# EAGLE design USBDroidR3 (EAGLE 6.2)
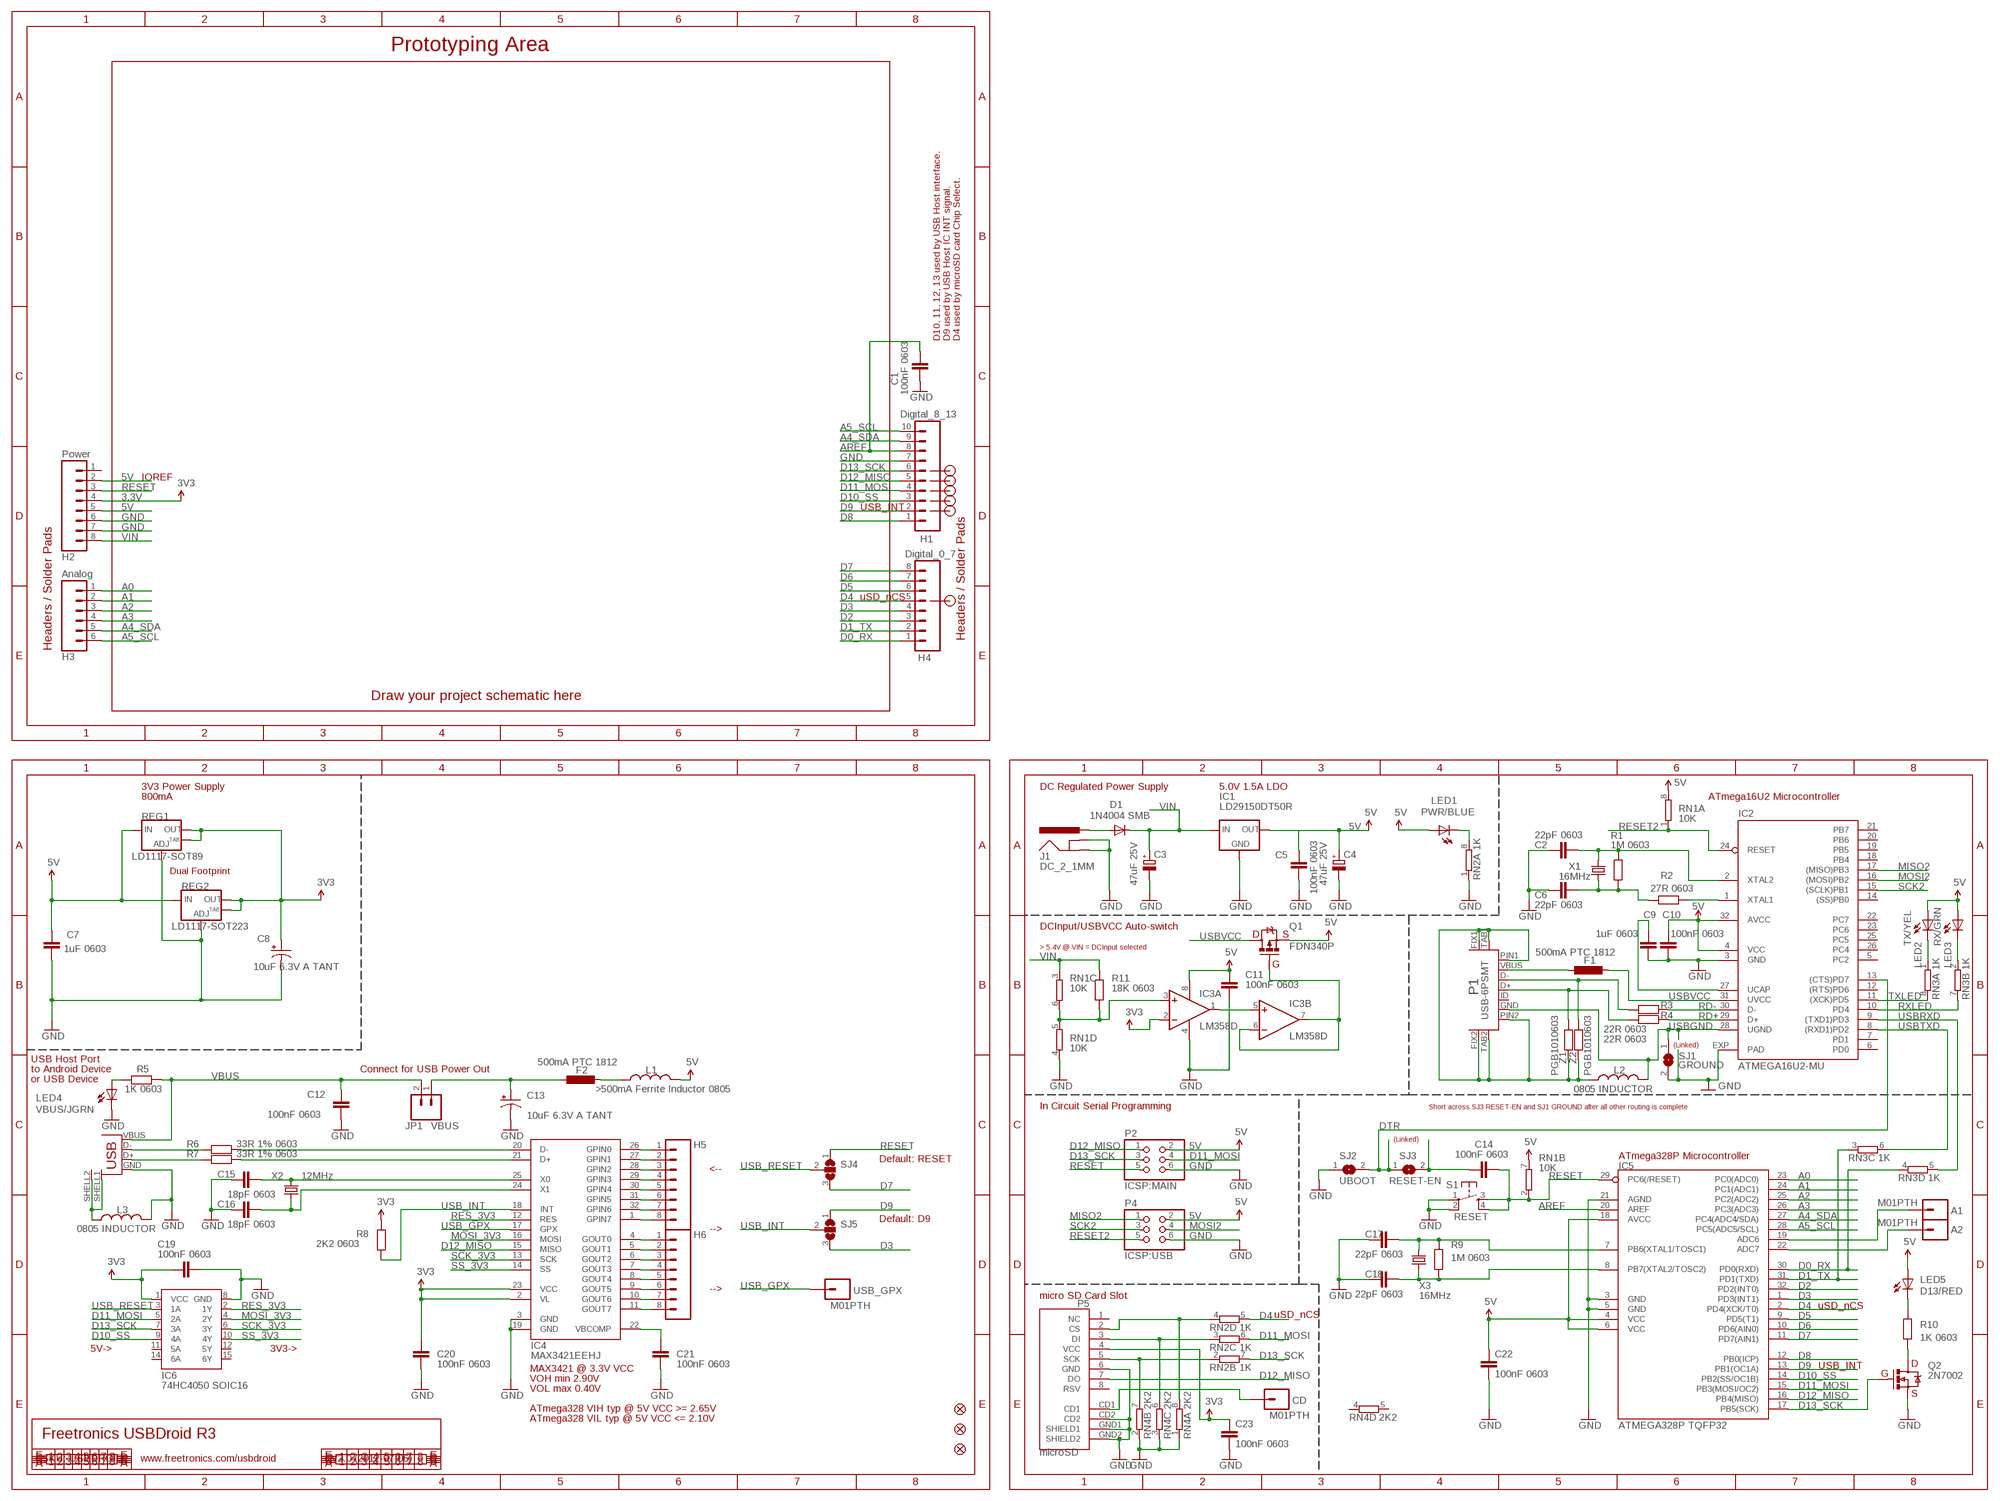
[diagram p0: schematic, sheet 1]

## Parts
A1  M01PTH  [1X01]
A2  M01PTH  [1X01]
C1  100nF 0603  CAP0603  [0603]
C2  22pF 0603  CAP0603  [0603]
C3  47uF 25V  CPOL-EUD  [PANASONIC_D]
C4  47uF 25V  CPOL-EUD  [PANASONIC_D]
C5  100nF 0603  CAP0603  [0603]
C6  22pF 0603  CAP0603  [0603]
C7  1uF 0603  CAP0603  [0603]
C8  10uF 6.3V A TANT  CAP_POL1206  [EIA3216]
C9  1uF 0603  CAP0603  [0603]
C10  100nF 0603  CAP0603  [0603]
C11  100nF 0603  CAP0603  [0603]
C12  100nF 0603  CAP0603  [0603]
C13  10uF 6.3V A TANT  CAP_POL1206  [EIA3216]
C14  100nF 0603  CAP0603  [0603]
C15  18pF 0603  CAP0603  [0603]
C16  18pF 0603  CAP0603  [0603]
C17  22pF 0603  CAP0603  [0603]
C18  22pF 0603  CAP0603  [0603]
C19  100nF 0603  CAP0603  [0603]
C20  100nF 0603  CAP0603  [0603]
C21  100nF 0603  CAP0603  [0603]
C22  100nF 0603  CAP0603  [0603]
C23  100nF 0603  CAP0603  [0603]
CD  M01PTH  [1X01]
D1  1N4004 SMB  DIODESMB  [SMB-DIODE]
F1  500mA PTC 1812  L-EUL1812  [L1812]
F2  500mA PTC 1812  L-EUL1812  [L1812]
FID1  FIDUCIAL1X2.5  [FIDUCIAL-1X2.5]
FID2  FIDUCIAL1X2.5  [FIDUCIAL-1X2.5]
FID3  FIDUCIAL1X2.5  [FIDUCIAL-1X2.5]
H1  Digital_8_13  M100.1  [1X10]
H2  Power  M08  [1X08]
H3  Analog  M06SIP  [1X06]
H4  Digital_0_7  M08  [1X08]
H5  GPIN  M08  [1X08]
H6  GPIN  M08  [1X08]
IC1  LD29150DT50R  V_REG_78XX  [DPACK]
IC2  ATMEGA16U2-MU  ATMEL_ATMEGA8U2-MUQFN  [ATMEL_QFN32]
IC3  LM358D  [SO08]
IC4  MAX3421EEHJ  MAX3421ESMD  [TQFP32-5MM]
IC5  ATMEGA328P TQFP32  AVR-MEGA8-AI  [TQFP32-08]
IC6  74HC4050 SOIC16  HEX_CONVERTER  [SO016]
J1  DC_2_1MM  POWER_JACKPTH  [POWER_JACK_PTH]
JP1  VBUS  M02LOCK  [1X02_LOCK]
L1  >500mA Ferrite Inductor 0805  INDUCTOR0805-LARGE  [0805-LARGE]
L2  0805 INDUCTOR  INDUCTOR0805-LARGE  [0805-LARGE]
L3  0805 INDUCTOR  INDUCTOR0805-LARGE  [0805-LARGE]
LED1  PWR/BLUE  LED0603  [LED-0603]
LED2  TX/YEL  LED0603  [LED-0603]
LED3  RX/GRN  LED0603  [LED-0603]
LED4  VBUS/JGRN  LED0603  [LED-0603]
LED5  D13/RED  LED0603  [LED-0603]
P1  USB-6PSMT  [USB-MICROB-MB05PMXX]
P2  ICSP:MAIN  PINHD-2X3  [2X03]
P3  USB_  [USB-A-S-SILK-FEMALE]
P4  ICSP:USB  PINHD-2X3  [2X03]
P5  microSD  USD-SOCKETNEW  [MICRO-SD-SOCKET-PP]
Q1  FDN340P  MOSFET-PCHANNEL  [SOT23]
Q2  2N7002  MOSFET-NCHANNELSMD  [SOT23-3]
R1  1M 0603  RESISTOR0603  [0603]
R2  27R 0603  RESISTOR0603  [0603]
R3  22R 0603  RESISTOR0603  [0603]
R4  22R 0603  RESISTOR0603  [0603]
R5  1K 0603  RESISTOR0603  [0603]
R6  33R 1% 0603  RESISTOR0603  [0603]
R7  33R 1% 0603  RESISTOR0603  [0603]
R8  2K2 0603  RESISTOR0603  [0603]
R9  1M 0603  RESISTOR0603  [0603]
R10  1K 0603  RESISTOR0603  [0603]
R11  18K 0603  RESISTOR0603  [0603]
REG1  LD1117-SOT89  V_REG_LM1117SOT89  [SOT89]
REG2  LD1117-SOT223  V_REG_LM1117SOT223  [SOT223]
RN1  10K  4R-NCAY16  [CAY16]
RN2  1K  4R-NCAY16  [CAY16]
RN3  1K  4R-NCAY16  [CAY16]
RN4  2K2  4R-NCAY16  [CAY16]
S1  RESET  TAC_SWITCHSMD  [TACTILE_SWITCH_SMD]
SJ1  GROUND  SJ  [SJ]
SJ2  UBOOT  SJ  [SJ]
SJ3  RESET-EN  SJ  [SJ]
SJ4  SJ2W  [SJ_2]
SJ5  SJ2W  [SJ_2]
USB_GPX  M01PTH  [1X01]
X1  16MHz  CRYSTALHC49UV  [HC49U-V]
X2  12MHz  CRYSTALHC49UV  [HC49U-V]
X3  16MHz  CRYSTALHC49UV  [HC49U-V]
Z1  PGB1010603  RESISTOR0603  [0603]
Z2  PGB1010603  RESISTOR0603  [0603]

## Nets
3.3V: C8.A(+) C19.2 C20.2 C23.1 H2.4 IC3.2(A:-IN) IC4.2(VL) IC4.23(VCC) IC6.1(VCC) P5.4(VCC) R8.1 REG1.2(OUT) REG1.4(OUT) REG2.2(OUT) REG2.4(OUT) ; supply symbol labelled 3V3
5V [power]: C4.+ C5.1 C7.1 C10.1 C11.1 C22.1 H2.2 H2.5 IC1.3(OUT) IC2.4(VCC) IC2.32(AVCC) IC3.8(P:V+) IC5.4(VCC) IC5.6(VCC) IC5.18(AVCC) L1.2 LED1.A LED2.A LED3.A LED5.A P2.2 P4.2 Q1.2(S) REG1.3(IN) REG2.3(IN) RN1.7 RN1.8
A0: H3.1 IC5.23(PC0(ADC0))
A1: H3.2 IC5.24(PC1(ADC1))
A2: H3.3 IC5.25(PC2(ADC2))
A3: H3.4 IC5.26(PC3(ADC3))
A4_SDA: H1.9 H3.5 IC5.27(PC4(ADC4/SDA))
A5_SCL: H1.10 H3.6 IC5.28(PC5(ADC5/SCL))
AREF: C1.1 H1.8 IC5.20(AREF)
D0_RX: H4.1 IC5.30(PD0(RXD)) RN3.4
D1_TX: H4.2 IC5.31(PD1(TXD)) RN3.3
D2: H4.3 IC5.32(PD2(INT0))
D3: H4.4 IC5.1(PD3(INT1)) SJ5.3
D4: H4.5 IC5.2(PD4(XCK/T0)) RN2.5
D5: H4.6 IC5.9(PD5(T1))
D6: H4.7 IC5.10(PD6(AIN0))
D7: H4.8 IC5.11(PD7(AIN1)) SJ4.3
D8: H1.1 IC5.12(PB0(ICP))
D9: H1.2 IC5.13(PB1(OC1A)) SJ5.1
D10_SS: H1.3 IC5.14(PB2(SS/OC1B)) IC6.9(4A)
D11_MOSI: H1.4 IC5.15(PB3(MOSI/OC2)) IC6.5(2A) P2.4 RN2.6
D12_MISO: H1.5 IC4.15(MISO) IC5.16(PB4(MISO)) P2.1 P5.7(DO)
D13_SCK: H1.6 IC5.17(PB5(SCK)) IC6.7(3A) P2.3 Q2.1(G) RN2.7
DTR: IC2.13((CTS)PD7) SJ2.2 SJ3.1
GND: C1.2 C2.1 C3.- C4.- C5.2 C6.1 C7.2 C8.C(-) C9.2 C10.2 C11.2 C12.1 C13.C(-) C15.1 C16.1 C17.1 C18.1 C19.1 C20.1 C21.1 C22.2 C23.2 H1.7 H2.6 H2.7 IC1.2(GND) IC2.3(GND) IC2.EXP(PAD) IC3.4(P:V-) IC4.3(GND) IC4.19(GND) IC5.3(GND) IC5.5(GND) IC5.21(AGND) IC6.8(GND) J1.GND J1.GNDBREAK L3.2 LED4.C P2.6 P3.GND P4.6 P5.6(GND) P5.CD2 P5.GND1(SHIELD1) P5.GND2(SHIELD2) Q2.2(S) REG1.1(ADJ) REG2.1(ADJ) RN1.4 RN2.1 RN4.1 RN4.2 RN4.3 S1.1 S1.2 SJ1.2 SJ2.1
MISO2: IC2.17((MISO)PB3) P4.1
MOSI2: IC2.16((MOSI)PB2) P4.4
MOSI_3V3: IC4.16(MOSI) IC6.4(2Y)
N$1: P3.D- R6.2
N$2: C17.2 IC5.7(PB6(XTAL1/TOSC1)) R9.2 X3.2
N$3: P3.D+ R7.2
N$4: LED5.C R10.2
N$5: IC4.20(D-) R6.1
N$6: Q2.3(D) R10.1
N$7: C18.2 IC5.8(PB7(XTAL2/TOSC2)) R9.1 X3.1
N$8: IC2.1(XTAL1) R2.1
N$10: IC4.21(D+) R7.1
N$11: LED3.C RN3.2
N$12: IC3.3(A:+IN) R11.1 RN1.5 RN1.6
N$13: LED2.C RN3.1
N$14: LED1.C RN2.8
N$15: H5.1 IC4.26(GPIN0)
N$16: P1.D+ R4.2 Z1.1
N$17: P1.D- R3.2 Z2.1
N$18: IC3.6(B:-IN) IC3.7(B:OUT) Q1.1(G)
N$19: IC3.1(A:OUT) IC3.5(B:+IN)
N$20: P5.2(CS) RN2.4 RN4.8
N$21: A2.1 IC5.22(ADC7)
N$22: A1.1 IC5.19(ADC6)
N$23: CD.1 P5.CD1
N$24: P5.5(SCK) RN2.2 RN4.7
N$25: P5.3(DI) RN2.3 RN4.6
N$26: H5.2 IC4.27(GPIN1)
N$27: C15.2 IC4.25(X0) X2.2
N$28: H5.3 IC4.28(GPIN2)
N$29: C13.A(+) F2.1 JP1.1
N$30: C16.2 IC4.24(X1) X2.1
N$31: H5.4 IC4.29(GPIN3)
N$32: H5.5 IC4.30(GPIN4)
N$33: H5.6 IC4.31(GPIN5)
N$34: H5.7 IC4.32(GPIN6)
N$35: H5.8 IC4.1(GPIN7)
N$36: H6.1 IC4.4(GOUT0)
N$37: H6.2 IC4.5(GOUT1)
N$38: H6.3 IC4.6(GOUT2)
N$39: H6.4 IC4.7(GOUT3)
N$40: H6.5 IC4.8(GOUT4)
N$41: H6.6 IC4.9(GOUT5)
N$42: H6.7 IC4.10(GOUT6)
N$43: H6.8 IC4.11(GOUT7)
N$44: LED4.A R5.1
N$45: L3.1 P3.SHELL1 P3.SHELL2
N$46: F2.2 L1.1
N$48: C21.2 IC4.22(VBCOMP)
N$49: C14.1 SJ3.2
N$51: L2.1 P1.FIX1 P1.FIX2 P1.PIN1 P1.PIN2 P1.TAB1 P1.TAB2 Z1.2 Z2.2
N$60: D1.A J1.PWR
N$113: C2.2 IC2.2(XTAL2) R1.2 X1.2
N$114: C6.2 R1.1 R2.2 X1.1
N$115: F1.1 P1.VBUS
N$117: C9.1 IC2.27(UCAP)
RD+: IC2.29(D+) R4.1
RD-: IC2.30(D-) R3.1
RES_3V3: IC4.12(RES) IC6.2(1Y)
RESET: C14.2 H2.3 IC5.29(PC6(/RESET)) P2.5 RN1.2 S1.3 S1.4 SJ4.1
RESET2: IC2.24(RESET) P4.5 RN1.1
RXLED: IC2.10(PD4) RN3.7
SCK2: IC2.15((SCLK)PB1) P4.3
SCK_3V3: IC4.13(SCK) IC6.6(3Y)
SS_3V3: IC4.14(SS) IC6.10(4Y)
TXLED: IC2.11((XCK)PD5) RN3.8
USB_GPX: IC4.17(GPX) USB_GPX.1
USB_INT: IC4.18(INT) R8.2 SJ5.2
USB_RESET: IC6.3(1A) SJ4.2
USBGND: IC2.28(UGND) L2.2 P1.GND SJ1.1
USBRXD: IC2.9((TXD1)PD3) RN3.5
USBTXD: IC2.8((RXD1)PD2) RN3.6
USBVCC: F1.2 IC2.31(UVCC) Q1.3(D)
VBUS: C12.2 JP1.2 P3.VBUS R5.2
VIN: C3.+ D1.C H2.8 IC1.1(IN) R11.2 RN1.3
Unconnected: H2.1 IC2.5(PC2) IC2.6(PD0) IC2.7(PD1) IC2.12((RTS)PD6) IC2.14((SS)PB0) IC2.18(PB4) IC2.19(PB5) IC2.20(PB6) IC2.21(PB7) IC2.22(PC7) IC2.23(PC6) IC2.25(PC5) IC2.26(PC4) IC6.11(5A) IC6.12(5Y) IC6.14(6A) IC6.15(6Y) P1.ID P5.1(NC) P5.8(RSV) RN4.4 RN4.5

## Notes on the sheet
- Prototyping Area
- D10, 11, 12, 13 used by USB Host interface. | D9 used by USB Host IC INT signal. | D4 used by microSD card Chip Select.
- IOREF
- USB_INT
- uSD_nCS
- Headers / Solder Pads
- Headers / Solder Pads
- Draw your project schematic here
- 3V3 Power Supply | DC Regulated Power Supply | 5.0V 1.5A LDO
- 800mA | ATmega16U2 Microcontroller
- Dual Footprint
- DCInput/USBVCC Auto-switch
- D | S
- > 5.4V @ VIN = DCInput selected
- G
- (Linked)
- USB Host Port
- to Android Device | Connect for USB Power Out
- or USB Device
- In Circuit Serial Programming | Short across SJ3 RESET-EN and SJ1 GROUND after all other routing is complete
- (Linked)
- ATmega328P Microcontroller
- Default: RESET
- <--
- Default: D9
- -->
- -->
- micro SD Card Slot
- uSD_nCS
- uSD_nCS
- 5V-> | 3V3->
- USB_INT | D
- MAX3421 @ 3.3V VCC
- G
- VOH min 2.90V
- VOL max 0.40V
- S
- ATmega328 VIH typ @ 5V VCC >= 2.65V
- ATmega328 VIL typ @ 5V VCC <= 2.10V
- Freetronics USBDroid R3
- SKU: USBDROID | www.freetronics.com/usbdroid | V2.0 (2012-07-06)

## Library data of the parts
A1 A2 CD USB_GPX = freetronics-2:M01: Header 1 Standard 1-pin 0.1" header. Use with straight break away headers (SKU : PRT-00116), right angle break away headers (PRT-00553), swiss pins (PRT-00743), machine pins (PRT-00117), and female headers (PRT-00115).
C1 C2 C5-C7 C9-C12 C14-C23 = freetronics:CAP: Capacitor Standard 0603 ceramic capacitor, and 0.1" leaded capacitor.
C3 C4 = rcl:CPOL-EU: POLARIZED CAPACITOR, European symbol
C8 C13 = freetronics:CAP_POL: Capacitor Polarized These are standard SMD and PTH capacitors. Normally 10uF, 47uF, and 100uF in electrolytic and tantalum varieties. Always verify the external diameter of the through hole cap, it varies with capacity, voltage, and manufacturer. The EIA devices should be standard.
D1 = freetronics:DIODE: Diode These are standard reverse protection diodes and small signal diodes. SMA package can handle up to about 1A. SOD-323 can handle about 200mA. What the SOD-323 package when ordering, there are some mfgs out there that are 5-pin packages.
F1 F2 = rcl:L-EU: INDUCTOR, European symbol
FID1-FID3 = freetronics:FIDUCIAL: Fiducial Alignment Points Various fiducial points for machine vision alignment.
H1 = freetronics-original:M10: Header 10 Standard 10-pin 0.1" header. Use with straight break away headers (SKU : PRT-00116), right angle break away headers (PRT-00553), swiss pins (PRT-00743), machine pins (PRT-00117), and female headers (PRT-00115).
H2 = freetronics-master-v1:M08: Header 8 Standard 8-pin 0.1" header. Use with straight break away headers (SKU : PRT-00116), right angle break away headers (PRT-00553), swiss pins (PRT-00743), machine pins (PRT-00117), and female headers (PRT-00115).
H3 = freetronics:M06: Header 6 Standard 6-pin 0.1" header. Use with straight break away headers (SKU : PRT-00116), right angle break away headers (PRT-00553), swiss pins (PRT-00743), machine pins (PRT-00117), and female headers (PRT-00115). Molex polarized connector foot print use with SKU : PRT-08094 with associated crimp pins and housings. NOTES ON THE VARIANTS LOCK and LOCK_LONGPADS... This footprint was designed to help hold the alignment of a through-hole component (i.e. 6-pin header) while soldering it into place. You may notice that each hole has been shifted either up or down by 0.005 of an inch from it's more standard position (which is a perfectly straight line). This slight alteration caused the pins (the squares in the middle) to touch the edges of the holes. Because they are alternating, it causes a "brace" to hold the component in place. 0.005 has proven to be the perfect amount of "off-center" position when using our standard breakaway headers. Although looks a little odd when you look at the bare footprint, once you have a header in there, the alteration is very hard to notice. Also, if you push a header all the way into place, it is covered up entirely on the bottom side. This idea of altering the position of holes to aid alignment will be further integrated into the Sparkfun Library for other footprints. It can help hold any component with 3 or more connection pins.
H4-H6 = freetronics:M08: Header 8 Standard 8-pin 0.1" header. Use with straight break away headers (SKU : PRT-00116), right angle break away headers (PRT-00553), swiss pins (PRT-00743), machine pins (PRT-00117), and female headers (PRT-00115).
IC1 = freetronics-master-v1:V_REG_78XX: Voltage Regulator Standard 7805 5V regulator. IGO (Input Ground Output). Spark Fun Electronics SKU : COM-00107
IC2 = freetronics-jon:ATMEL_ATMEGA8U2-MU
IC3 = linear:LM358: OP AMP also LM158; LM258; LM2904 Source: http://cache.national.com/ds/LM/LM158.pdf
IC4 = freetronics-master-v1:MAX3421E: USB Peripheral/Host Controller w/ SPI
IC5 = freetronics-2:AVR-MEGA8: MICROCONTROLLER 8 Kbytes FLASH 1 kbytes SRAM 512 bytes EEPROM USART 6-channel 10 bit ADC 2-channel 8 bit ADC
IC6 = freetronics-master-v1:HEX_CONVERTER
J1 = freetronics:POWER_JACK: Power Jack This is the standard 5.5mm barrel jack for power. The PTH is the most common, proven, reliable, footprint. All others are experimental. The Slot footprint only works if the mill layer is transmitted to the PCB fab house so be warned. Spark Fun Electronics SKU : PRT-00119. Mating wall wart : TOL-00298 (and others)
JP1 = freetronics-master-v1:M02: Header 2 Standard 2-pin 0.1" header. Use with straight break away headers (SKU : PRT-00116), right angle break away headers (PRT-00553), swiss pins (PRT-00743), machine pins (PRT-00117), and female headers (PRT-00115). Molex polarized connector foot print use with SKU : PRT-08233 with associated crimp pins and housings.
L1-L3 = freetronics-master-v1:INDUCTOR: Inductors Basic Inductor/Choke - 0603 and 1206. Footprints are not proven and vary greatly between part numbers.
LED1-LED5 = freetronics:LED: LEDs Standard schematic elements and footprints for 5mm, 3mm, 1206, and 0603 sized LEDs. 5mm - Spark Fun Electronics SKU : COM-00529 (and others)
P1 = freetronics-jon:USB-6P
P2 P4 = pinhead:PINHD-2X3: PIN HEADER
P3 = freetronics-master-v1:USB: USB Connectors USB-B-PTH is fully proven SKU : PRT-00139 USB-miniB is fully proven SKU : PRT-00587 USB-A-PCB is untested. USB-A-H is throughly reviewed, but untested. Spark Fun Electronics SKU : PRT-00437 USB-B-SMT is throughly reviewed, but untested. Needs silkscreen touching up. USB-A-S has not been used/tested USB-MB-H has not been used/tested
P5 = freetronics-master-v1:USD-SOCKET: microSD Socket Push-push type uSD socket. Schematic element and footprint production proven. Spark Fun Electronics SKU : PRT-00127. tDoc lines correctly indicate media card edge positions when inserting (unlocked, locked, depressed).
Q1 = freetronics-master-v1:MOSFET-PCHANNEL
Q2 = freetronics:MOSFET-NCHANNEL
R1-R11 Z1 Z2 = freetronics:RESISTOR: Resistor Basic schematic elements and footprints for 0603, 1206, and PTH 1/10th watt (small) resistors.
REG1 REG2 = freetronics:V_REG_LM1117: Voltage Regulator LD1117 Adjustable low-dropout voltage regulator available in SOT89 and SOT223 SMT packages.
RN1-RN4 = freetronics-master-v1:4R-N: Array Chip Resistor Source: RS Component / Phycomp
S1 = freetronics:TAC_SWITCH: Momentary Switch Button commonly used for reset or general input. Spark Fun Electronics SKU : COM-00097
SJ1-SJ3 = jumper:SJ: SMD solder JUMPER
SJ4 SJ5 = freetronics-master-v1:SJ2W: SMD solder JUMPER
X1-X3 = freetronics-master-v1:CRYSTAL: Crystals Various standard crystals. Proven footprints. Spark Fun Electronics SKU : COM-00534

## Net classes
0 default: width 0.152 mm

## Board
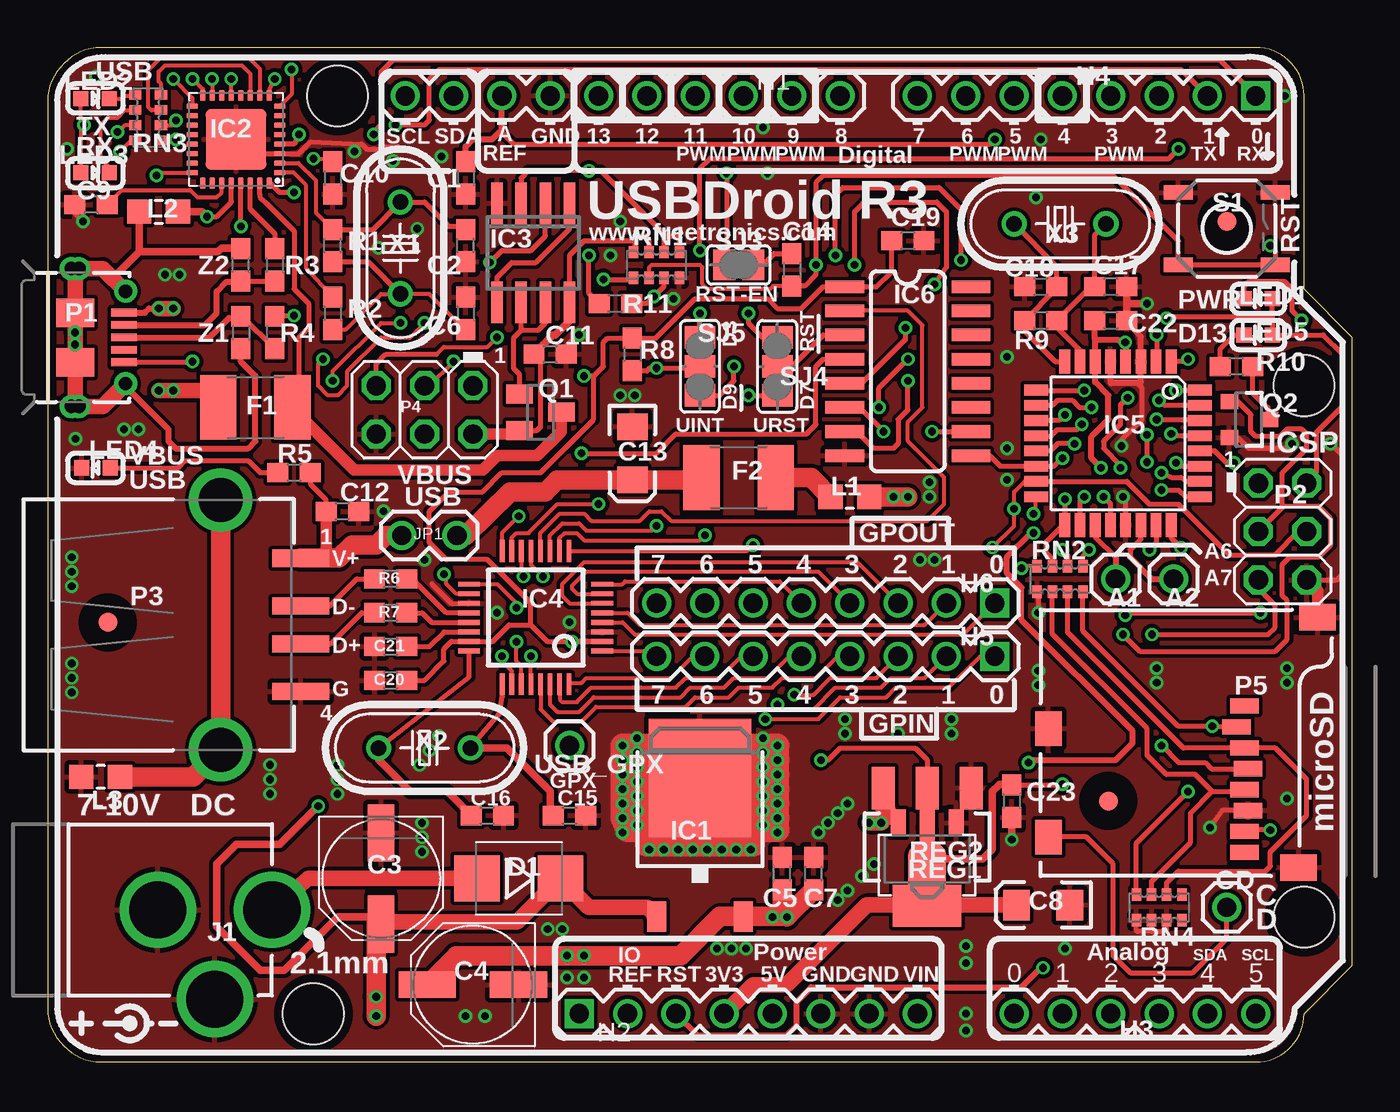
[diagram p1: board, top side]
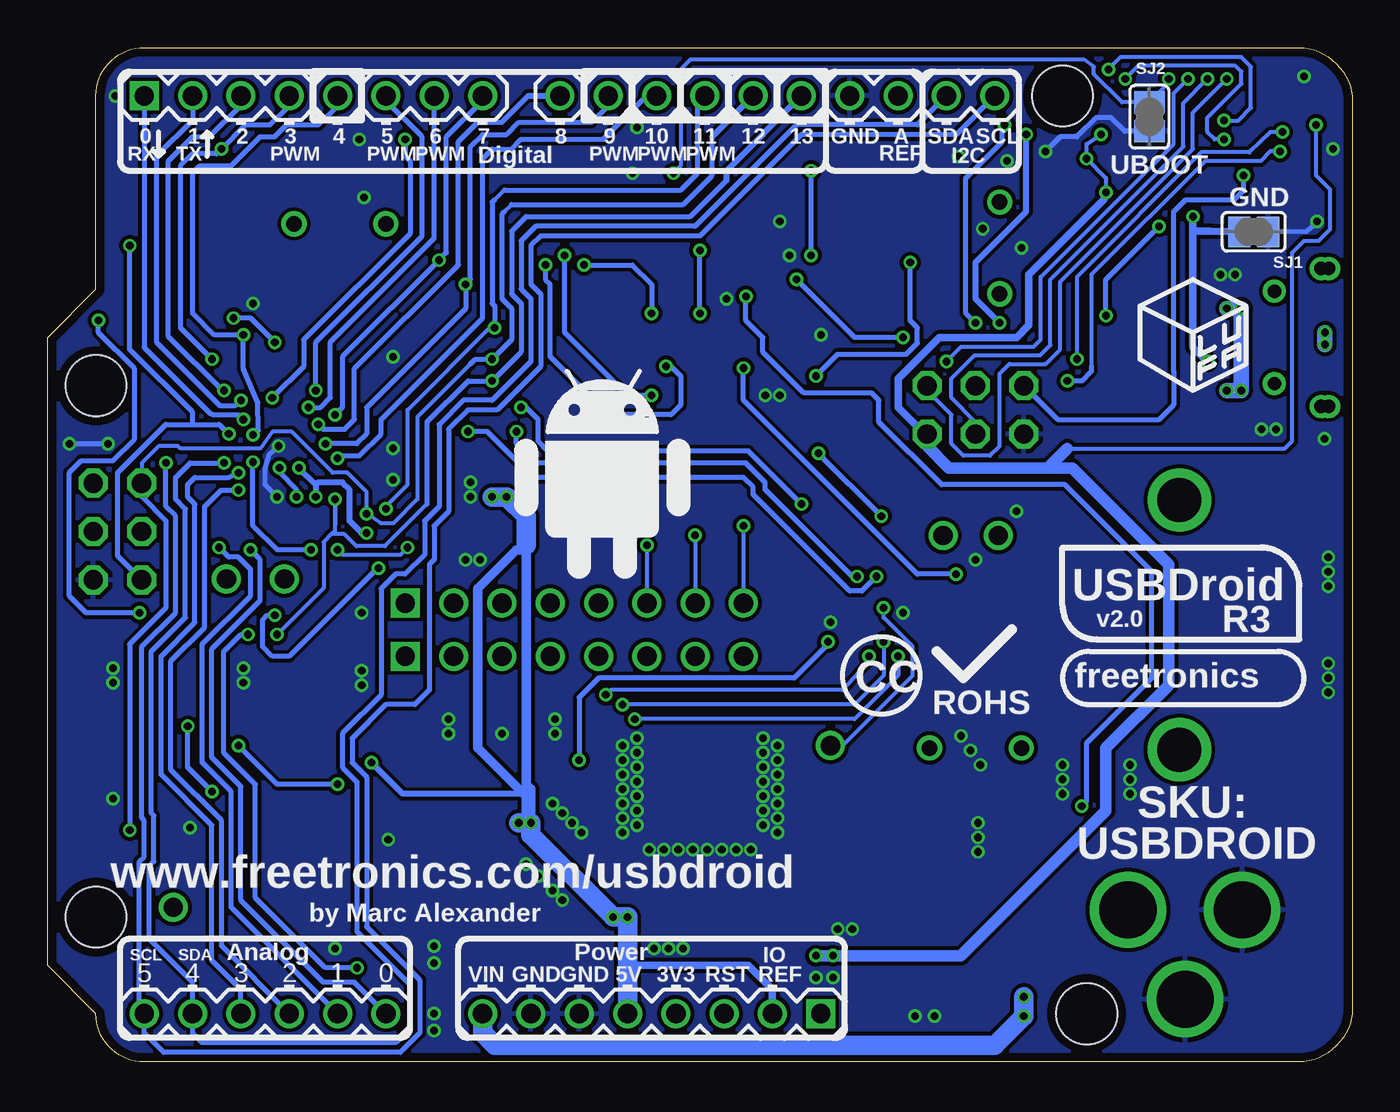
[diagram p2: board, bottom side, seen from below]

Size 68.58 x 53.34 mm. Coordinates in mm from the lower left corner, seen from the top.
Outline: 0,2.54 arc74 2.54,0 63.5,0 arc90 66.04,2.54 68.58,5.08 68.58,38.1 66.04,40.64 66.04,50.8 arc90 63.5,53.34 2.54,53.34 arc74 0,50.8 0,2.54
Copper layers (1*16): Top 0.035mm / dielectric 1.5mm / Bottom 0.035mm
Design rules: minimum track width 8mil, minimum drill 15mil, track to track 8mil, track to pad 8mil, pad to pad 8mil, via to via 8mil, smd to smd 8mil, copper to edge 18mil, drill to drill 8mil, minimum pad ring 10mil, minimum via ring 6mil, stop-mask expansion 4mil, vias tented up to drill 25mil, thermal gap 10mil
Holes 3.2 mm at 66.04,35.56 66.04,7.62 13.97,2.54 15.24,50.8
tRestrict: area 61,43.2 to 63,45.2; area 54.7,12.7 to 56.8,14.7; area 2.2,22.1 to 4.2,24.1

### Footprints (pad centres in the part's own frame; a part is rotated, then mirrored left to right if it is on the bottom)
1X01 = drill 1.016: 1 0,0
0603 = smd 1.1 x 1: 1 -0.85,0; 2 0.85,0
PANASONIC_D = smd 3 x 1.4: + 2.4,0; - -2.4,0
EIA3216 = smd 1.4 x 1.6: A 1.4,0; C -1.4,0
SMB-DIODE = smd 2.4 x 2.4: A 2.2,0; C -2.2,0
L1812 = smd 1.9 x 3.4: 1 -1.95,0; 2 1.95,0
FIDUCIAL-1X2.5 = smd 1 x 1: 1 0,0
1X10 = drill 1.016: 1 0,0; 2 2.54,0; 3 5.08,0; 4 7.62,0; 5 10.16,0; 6 12.7,0; 7 15.24,0; 8 17.78,0; 9 20.32,0; 10 22.86,0
1X08 = drill 1.016 square: 1 0,0 | drill 1.016: 2 2.54,0; 3 5.08,0; 4 7.62,0; 5 10.16,0; 6 12.7,0; 7 15.24,0; 8 17.78,0
1X06 = drill 1.016: 1 0,0; 2 2.54,0; 3 5.08,0; 4 7.62,0; 5 10.16,0; 6 12.7,0
DPACK = smd 1 x 1.6: 1 -2.28,-4.8; 3 2.28,-4.8 | smd 5.4 x 6.2: 2 0,2.5
ATMEL_QFN32 = smd 0.6 x 0.3: 1 -2.3,1.75; 2 -2.3,1.25; 3 -2.3,0.75; 4 -2.3,0.25; 5 -2.3,-0.25; 6 -2.3,-0.75; 7 -2.3,-1.25; 8 -2.3,-1.75; 17 2.3,-1.75; 18 2.3,-1.25; 19 2.3,-0.75; 20 2.3,-0.25; 21 2.3,0.25; 22 2.3,0.75; 23 2.3,1.25; 24 2.3,1.75 | smd 0.3 x 0.6: 9 -1.75,-2.3; 10 -1.25,-2.3; 11 -0.75,-2.3; 12 -0.25,-2.3; 13 0.25,-2.3; 14 0.75,-2.3; 15 1.25,-2.3; 16 1.75,-2.3; 25 1.75,2.3; 26 1.25,2.3; 27 0.75,2.3; 28 0.25,2.3; 29 -0.25,2.3; 30 -0.75,2.3; 31 -1.25,2.3; 32 -1.75,2.3 | smd 3.2 x 3.2: EXP 0,0
SO08 = smd 0.6 x 2.2: 1 -1.905,-2.6; 2 -0.635,-2.6; 3 0.635,-2.6; 4 1.905,-2.6; 5 1.905,2.6; 6 0.635,2.6; 7 -0.635,2.6; 8 -1.905,2.6
TQFP32-5MM = smd 1.143 x 0.254: 1 -3.5,1.75; 2 -3.5,1.25; 3 -3.5,0.75; 4 -3.5,0.25; 5 -3.5,-0.25; 6 -3.5,-0.75; 7 -3.5,-1.25; 8 -3.5,-1.75; 17 3.5,-1.75; 18 3.5,-1.25; 19 3.5,-0.75; 20 3.5,-0.25; 21 3.5,0.25; 22 3.5,0.75; 23 3.5,1.25; 24 3.5,1.75 | smd 0.254 x 1.143: 9 -1.75,-3.5; 10 -1.25,-3.5; 11 -0.75,-3.5; 12 -0.25,-3.5; 13 0.25,-3.5; 14 0.75,-3.5; 15 1.25,-3.5; 16 1.75,-3.5; 25 1.75,3.5; 26 1.25,3.5; 27 0.75,3.5; 28 0.25,3.5; 29 -0.25,3.5; 30 -0.75,3.5; 31 -1.25,3.5; 32 -1.75,3.5
TQFP32-08 = smd 1.27 x 0.559: 1 -4.293,2.8; 2 -4.293,2; 3 -4.293,1.2; 4 -4.293,0.4; 5 -4.293,-0.4; 6 -4.293,-1.2; 7 -4.293,-2; 8 -4.293,-2.8; 17 4.293,-2.8; 18 4.293,-2; 19 4.293,-1.2; 20 4.293,-0.4; 21 4.293,0.4; 22 4.293,1.2; 23 4.293,2; 24 4.293,2.8 | smd 0.559 x 1.27: 9 -2.8,-4.293; 10 -2,-4.293; 11 -1.2,-4.293; 12 -0.4,-4.293; 13 0.4,-4.293; 14 1.2,-4.293; 15 2,-4.293; 16 2.8,-4.293; 25 2.8,4.293; 26 2,4.293; 27 1.2,4.293; 28 0.4,4.293; 29 -0.4,4.293; 30 -1.2,4.293; 31 -2,4.293; 32 -2.8,4.293
SO016 = smd 0.66 x 2.032: 1 -4.445,-3.315; 2 -3.175,-3.315; 3 -1.905,-3.315; 4 -0.635,-3.315; 5 0.635,-3.315; 6 1.905,-3.315; 7 3.175,-3.315; 8 4.445,-3.315; 9 4.445,3.315; 10 3.175,3.315; 11 1.905,3.315; 12 0.635,3.315; 13 -0.635,3.315; 14 -1.905,3.315; 15 -3.175,3.315; 16 -4.445,3.315
POWER_JACK_PTH = drill 2.997: GND 0,7.7; GNDBREAK 4.7,10.7; PWR 0,13.7
1X02_LOCK = drill 1.016: 1 -0.178,0; 2 2.718,0
0805-LARGE = smd 1.27 x 1.27: 1 -1.016,0; 2 1.016,0
LED-0603 = smd 0.8 x 0.8: A 0,-0.75; C 0,0.75
USB-MICROB-MB05PMXX = smd 0.4 x 1.35: D+ 0,2.575; D- -0.65,2.575; GND 1.3,2.575; ID 0.65,2.575; VBUS -1.3,2.575 | smd 1.5 x 2: FIX1 -1.3,0; FIX2 1.3,0 | drill 0.7: PIN1 -2.425,2.65; PIN2 2.425,2.65; SLOT1 -3.625,-0.2; SLOT2 3.625,-0.2; TAB1 -3.625,0.2; TAB2 3.625,0.2
2X03 = drill 1.016 octagon: 1 -2.54,-1.27; 2 -2.54,1.27; 3 0,-1.27; 4 0,1.27; 5 2.54,-1.27; 6 2.54,1.27
USB-A-S-SILK-FEMALE = smd 3 x 0.9: D+ 7.212,-1; D- 7.212,1; GND 7.212,-3.5; VBUS 7.212,3.5 | drill 2.311: SHELL1 3,6.566; SHELL2 3,-6.566
MICRO-SD-SOCKET-PP = smd 0.8 x 1.5: 1 -8.94,10.7; 2 -7.84,10.3; 3 -6.74,10.7; 4 -5.64,10.9; 5 -4.54,10.7; 6 -3.44,10.9; 7 -2.34,10.7; 8 -1.24,10.7 | smd 1.8 x 1.4: CD1 -2.05,0.4; CD2 -7.75,0.4 | smd 1.4 x 1.9: GND1 -0.45,13.55; GND2 -13.6,14.55
SOT23 = smd 1 x 1.4: 1 -0.95,-1.1; 2 0.95,-1.1; 3 0,1.1
SOT23-3 = smd 0.8 x 0.9: 1 -0.95,-1; 2 0.95,-1; 3 0,1.1
SOT89 = smd 0.8 x 1.4: 1 -1.524,-1.905; 3 1.524,-1.905 | smd 0.8 x 1.9: 2 0,-1.651 | smd 2.032 x 3.65: 4 0,0.94
SOT223 = smd 1.219 x 2.235: 1 -2.311,-3.099; 2 0,-3.099; 3 2.311,-3.099 | smd 3.6 x 2.2: 4 0,3.099
CAY16 = smd 0.5 x 0.65: 1 -1.2,-0.675; 2 -0.4,-0.675; 3 0.4,-0.675; 4 1.2,-0.675; 5 1.2,0.675; 6 0.4,0.675; 7 -0.4,0.675; 8 -1.2,0.675
TACTILE_SWITCH_SMD = smd 1.524 x 0.762: 1 -2.54,1.905; 2 2.54,1.905; 3 -2.54,-1.905; 4 2.54,-1.905
SJ = smd 1.168 x 1.6: 1 -0.762,0; 2 0.762,0
SJ_2 = smd 1.168 x 1.6: 1 -1.524,0; 2 0,0; 3 1.524,0
HC49U-V = drill 0.813: 1 -2.413,0; 2 2.413,0

### Placement (x,y rotation side)
A1  56.13,25.4 0 top
A2  59.18,25.4 0 top
C1  21.97,46.48 270 top
C2  21.97,42.93 90 top
C3  17.53,9.65 270 top
C4  22.35,4.06 180 top
C5  38.61,9.91 90 top
C6  21.97,39.37 270 top
C7  40.26,9.91 90 top
C8  52.32,8.26 180 top
C9  2.29,45.09 180 top
C10  14.99,46.48 270 top
C11  26.42,37.21 0 top
C12  15.49,28.96 180 top
C13  30.73,32 270 top
C14  39.12,41.66 270 top
C15  27.43,12.95 180 top
C16  23.11,12.95 180 top
C17  55.88,40.77 180 top
C18  52.2,40.77 0 top
C19  45.21,43.18 180 top
C20  18.03,20.07 0 top
C21  18.03,21.84 0 top
C22  55.88,38.99 0 top
C23  50.67,13.72 270 top
CD  61.98,8.13 0 top
D1  24.77,9.65 180 top
F1  10.92,34.42 0 top
F2  36.32,30.73 0 top
FID1  3.17,23.11 0 top
FID2  61.98,44.2 0 top
FID3  55.75,13.72 0 top
H1  41.66,50.8 180 top
H2  27.94,2.54 0 top
H3  50.8,2.54 0 top
H4  63.5,50.8 180 top
H5  49.78,21.34 180 top
H6  49.78,24.13 180 top
IC1  34.29,12.45 0 top
IC2  9.91,48.51 180 top
IC3  25.53,42.55 180 top
IC4  25.65,23.37 180 top
IC5  56.26,32.53 270 top
IC6  45.21,36.32 270 top
J1  -1.91,8 270 top
JP1  21.34,27.69 180 top
L1  42.16,29.72 0 top
L2  5.84,44.7 0 top
L3  2.79,14.99 180 top
LED1  63.63,40.13 90 top
LED2  2.5,50.65 270 top
LED3  2.5,46.76 270 top
LED4  2.54,31.24 90 top
LED5  63.63,38.23 90 top
P1  1.45,38.1 270 top
P2  64.91,27.89 270 top
P3  6.1,22.99 0 top
P4  19.81,34.29 180 top
P5  52.2,9.78 270 top
Q1  25.91,34.16 270 top
Q2  63.12,33.78 270 top
R1  14.99,42.93 90 top
R2  14.99,39.37 270 top
R3  11.94,41.91 270 top
R4  11.94,38.35 270 top
R5  12.95,30.99 0 top
R6  18.03,25.4 180 top
R7  18.03,23.62 180 top
R8  30.73,37.21 270 top
R9  52.2,38.99 0 top
R10  62.48,36.58 180 top
R11  29.84,39.88 0 top
REG1  46.23,10.67 180 top
REG2  46.23,11.3 180 top
RN1  32,41.91 0 top
RN2  53.21,25.4 0 top
RN3  5.28,49.66 270 top
RN4  58.42,8.13 0 top
S1  61.98,43.81 0 top
SJ1  5.19,43.66 0 bottom
SJ2  10.67,49.7 90 bottom
SJ3  36.32,41.91 0 top
SJ4  38.35,36.58 270 top
SJ5  34.29,36.58 90 top
USB_GPX  27.43,16.64 0 top
X1  18.54,42.8 90 top
X2  19.81,16.51 0 top
X3  53.21,44.07 0 top
Z1  10.16,38.35 270 top
Z2  10.16,41.91 90 top

### Tracks (layer width: path | path; a pad name or v marks a point on that pad's centre or on a via)
3.3V  (via drill 0.4)
  Top 0.254: C20.2 19.81,20.07 20.83,21.08 20.83,21.72 21.23,22.12 IC4.23 | IC4.23 22.13,22.1 | IC4.23 23.39,22.12 24.26,22.99 25.4,22.99 | IC4.2 29.13,22.1 | IC3.2 26.16,43.43 25.4,42.67 23.88,42.67 v23.24,42.04 | 28.7,36.07 v28.19,36.07 | P5.4 61.16,15.42 60.83,15.75 59.44,15.75 v58.55,16.64 | v53.34,14.61 53.3,14.57 C23.1 | C19.2 44.36,41.57 43.56,40.77 IC6.1 40.77,40.77 39.62,39.62 38.35,39.62 37.85,40.13 34.04,40.13 31.96,38.06 R8.1 29.43,38.06 29.21,37.85 29.21,36.58 28.7,36.07 | 25.4,22.99 26.27,22.12 IC4.2 | IC4.2 27.58,22.12 v27.56,22.1 | v40.64,15.88 41.02,15.88 41.66,16.51 45.59,16.51 46.23,15.88 REG2.2 | 28.7,36.07 28.7,33.78 25.91,30.99 23.88,30.99 22.86,29.97 21.08,29.97 20.07,28.96 20.07,27.3 20.95,26.42 23.11,26.42 25.4,24.13 25.4,22.99
  Top 0.305: REG1.4 46.23,8.26 REG2.4
  Top 0.406: REG2.2 REG1.2 | 46.23,10.67 49.15,10.67 49.66,11.18 49.66,14.22 50.04,14.61 50.63,14.61 C23.1
  Top 0.813: C8.A 46.23,8.26 46.18,8.26 | REG2.4 46.18,8.26 | REG1.2 46.23,10.67 REG1.4 | 46.18,8.26 43.05,8.26 38.86,4.06 37.08,4.06 H2.4
  Bottom 0.254: v23.24,42.04 23.24,38.99 22.86,38.61 22.86,37.8 23.44,37.21 27.05,37.21 v28.19,36.07 | v58.55,16.64 56.52,14.61 v53.34,14.61 | v27.56,22.1 27.56,21.97 29.34,20.19 39.62,20.19 40.64,19.18 v40.64,15.88
5V  (via drill 0.4)
  Top 0.203: 1.75,49.28 LED2.A | 1.75,49.28 LED3.A | v1.91,49.28 1.75,49.28 | v13.97,47.5 14.82,47.5 C10.1
  Top 0.254: IC2.4 12.95,48.26 v13.21,48.77 | IC2.32 11.66,46.26 12.19,45.72 v12.95,45.72 | 64.38,39.19 LED5.A 67.06,38.23 68.07,37.21 68.07,34.48 66.67,33.08 66.67,30.99 66.18,30.49 P2.2 | 64.38,39.19 LED1.A | IC5.18 54.26,29.5 v54.48,29.72 | RN1.7 31.6,43.2 31.37,43.43 30.99,43.43 30.86,43.31 30.86,43.18 | 30.86,43.18 30.86,42.64 RN1.8 | IC3.8 27.43,42.42 28.19,43.18 30.86,43.18 | C11.1 25.91,36.87 25.91,33.4 25.72,33.21 Q1.2 | 64.38,39.19 58.85,39.19 v58.8,39.12 | v56.64,37.85 56.64,37.83 56.53,37.72
  Top 0.305: IC5.4 56.66,37.59 56.53,37.72 56.26,37.97 55.12,37.97 | 55.12,37.97 55.03,38.06 C22.1 | 55.12,37.97 55.06,37.92 IC5.6 55.06,35.74 55.75,35.05 55.75,33.78 54.86,32.89 54.86,31.75 v55.37,31.24 | v51.82,27.81 51.69,27.81 50.42,26.54 50.42,25.7 51.18,24.94 51.18,23.24 57.02,17.4 57.02,16.76 56.13,15.88 51.69,15.88 v51.56,15.75
  Top 0.406: REG2.3 REG1.3 | IC3.8 27.43,38.99 26.67,38.23 26.54,38.23 25.57,37.25 C11.1
  Top 0.61: Q1.2 24.61,33.02 P4.2 | v38.86,7.62 38.85,7.63 38.85,7.65
  Top 0.813: REG2.3 43.92,12.68 v43.81,12.57 v43.18,12.57
  Top 1.016: C5.1 38.61,8.13 38.97,7.77 38.85,7.65 IC1.3 35.33,7.65 33.27,5.59 v27.3,5.59 | v45.21,29.72 L1.2 | C7.1 38.86,7.66 v38.86,7.62 | 27.18,5.59 v27.3,5.59 | C4.+ 21.48,5.59 v27.3,5.59
  Bottom 0.203: v1.91,49.28 1.91,46.61 1.17,45.87 1.17,43.79 1.78,43.18 2.54,43.18 3.17,42.55 3.17,32.64 3.56,32.26 14.99,32.26 | v13.21,48.77 13.97,48.26 v13.97,47.5 12.95,46.48 v12.95,45.72
  Bottom 0.254: v54.48,29.72 54.48,30.1 | v58.8,39.12 57.91,39.12 v56.64,37.85 | P4.2 22.48,33.02
  Bottom 0.305: 54.48,30.35 v55.37,31.24 | 54.48,30.35 v54.48,29.72 | 54.48,30.35 54.36,30.48 53.09,30.48 52.7,30.1 52.7,28.45 52.07,27.81 v51.82,27.81 | v51.56,15.75 49.91,14.1 43.43,14.1 43.18,13.84 v43.18,12.57
  Bottom 0.406: 22.48,33.02 23.88,34.42 23.88,35.94 21.72,38.1 17.65,38.1 17.02,38.73 17.02,41.4 13.08,45.34 v12.95,45.72 | H2.2 30.48,3.81 31.75,5.08 38.1,5.08
  Bottom 0.508: 43.43,26.92 43.43,14.61 43.18,14.35 v43.18,12.57 | 43.43,26.92 43.43,27.18 | 43.43,26.92 43.94,26.92 45.97,24.89 45.97,16.51 43.43,13.97 43.43,12.23
  Bottom 0.61: 16,31.24 21.21,31.24 22.35,32.38 P4.2 | 16,31.24 14.99,32.26 | 16,31.24 14.73,31.24 9.65,26.16 9.65,19.81 12.95,16.51 12.95,13.21 20.57,5.59 v27.3,5.59 v28.19,5.59 | 39.08,7.87 C7.1 | 39.08,7.87 38.86,7.87 | 39.08,7.87 38.86,7.66 v38.86,7.62
  Bottom 1.016: v43.81,12.57 v43.18,12.57 43.18,11.94 v38.86,7.62 v38.1,7.62 38.1,5.08 H2.5 | v45.21,29.72 v44.45,29.72 43.43,28.7 43.43,27.18
A0  (via drill 0.4)
  Top 0.254: v57.91,26.92 58.29,27.3 58.29,28.2 IC5.23
  Bottom 0.254: H3.1 52.45,4.19 54.1,4.19 58.42,8.51 58.42,14.48 59.94,16 59.94,21.72 57.4,24.26 57.4,26.42 v57.91,26.92
A1  (via drill 0.4)
  Top 0.254: v59.56,27.05 59.06,27.55 IC5.24
  Bottom 0.254: H3.2 58.93,8.13 58.93,14.22 60.45,15.75 60.45,21.97 57.91,24.51 57.91,25.91 58.55,26.54 59.05,26.54 v59.56,27.05
A2  (via drill 0.4)
  Top 0.254: IC5.25 59.81,29.73 59.46,30.07 v58.55,30.07
  Bottom 0.254: H3.3 59.44,6.1 59.44,12.7 62.1,15.37 62.1,21.08 60.33,22.86 60.33,29.21 59.46,30.07 v58.55,30.07
A3  (via drill 0.4)
  Top 0.254: IC5.26 59.87,30.53 59.56,30.73 59.05,30.73 v58.55,30.99
  Bottom 0.254: H3.4 58.42,3.81 59.94,5.33 59.94,12.45 62.61,15.11 62.61,21.34 60.83,23.11 60.83,29.34 61.21,29.72 61.21,30.35 60.83,30.73 59.05,30.73 v58.55,30.99
A4_SDA  (via drill 0.4)
  Top 0.254: IC5.27 59.48,31.33 v59.31,31.5
  Bottom 0.254: v59.31,31.5 61.09,31.5 61.85,30.73 61.85,29.59 61.34,29.08 61.34,23.37 63.12,21.59 63.12,13.08 62.99,12.95 62.99,10.54 63.25,10.29 63.25,6.48 60.96,4.19 H3.5 60.96,1.52 60.45,1.02 50.29,1.02 49.53,1.78 49.53,4.06 52.32,6.86 52.32,14.73 53.09,15.49 53.09,17.27 51.05,19.3 51.05,24.89 50.29,25.65 49.78,25.65 48.77,26.67 48.77,28.45 48.01,29.21 48.01,33.53 46.74,34.8 45.21,34.8 43.18,36.83 43.18,40.13 43.69,40.64 43.69,43.18 42.93,43.94 34.54,43.94 29.21,49.28 22.86,49.28 H1.9
A5_SCL  (via drill 0.4)
  Top 0.254: IC5.28 61.34,32.13 61.98,31.5 v62.36,31.5
  Bottom 0.254: v62.36,31.5 62.36,29.21 61.85,28.7 61.85,23.62 63.63,21.84 63.63,12.83 63.5,12.7 63.5,10.79 63.75,10.54 63.75,2.79 H3.6 63.5,1.52 62.48,0.51 50.04,0.51 49.02,1.52 49.02,4.32 51.82,7.11 51.82,14.99 52.58,15.75 52.58,17.02 50.8,18.8 49.28,18.8 48.51,19.56 48.51,26.16 48.26,26.42 48.26,28.19 47.5,28.96 47.5,33.27 46.48,34.29 44.96,34.29 42.67,36.58 42.67,40.39 43.18,40.89 43.18,42.93 42.67,43.43 34.29,43.43 28.96,48.77 20.83,48.77 H1.10
AREF  (via drill 0.4)
  Top 0.254: IC5.20 55.86,29.36 v55.5,29.72 | v56.39,31.24 56.39,31.37 55.5,32.26 55.5,32.64 56.39,33.53 56.39,34.54 v56.77,34.92 | v49.78,48.51 49.53,48.26 24.51,48.26 23.88,48.9
  Top 0.305: H1.8 23.88,48.9 23.75,48.9 23.37,48.51 22.35,48.51 21.97,48.13 C1.1
  Bottom 0.254: v55.5,29.72 55.5,30.1 56.39,30.99 v56.39,31.24 | v56.77,34.92 55.12,36.58 55.12,37.97 49.53,43.56 49.53,47.37 49.78,47.62 v49.78,48.51
D0_RX  (via drill 0.4)
  Top 0.203: RN3.4 4.39,48.46 v3.81,47.88 | v14.99,35.81 14.99,36.32 17.53,38.86 v18.54,38.86
  Top 0.254: IC5.30 60.5,33.78 v58.29,33.78 | H4.1 61.59,52.7 18.16,52.7 17.53,52.07 17.53,49.28 17.14,48.9 v17.14,48.77
  Bottom 0.203: v3.81,47.88 4.32,47.88 4.83,47.37 7.75,47.37 13.72,41.4 13.72,36.58
  Bottom 0.254: H4.1 63.5,37.56 60.05,34.11 59.87,34.04 58.55,34.04 v58.29,33.78 | 13.72,36.58 13.72,36.32 14.22,35.81 v14.99,35.81
  Bottom 0.305: v17.14,48.77 17.14,44.7 19.81,42.04 19.81,40.13 v18.54,38.86
D1_TX  (via drill 0.4)
  Top 0.203: RN3.3 4.04,49.26 v3.68,48.9 | v14.48,36.96 14.22,36.7 14.22,35.56 14.73,35.05 15.24,35.05 15.75,35.56 15.75,36.32 17.53,38.1 19.05,38.1 v19.81,38.86
  Top 0.254: IC5.31 60.54,34.54 58.67,34.54 v58.42,34.8 | H4.2 59.56,52.2 20.57,52.2 20.07,51.69 20.07,49.53 19.81,49.28 v18.29,49.28
  Bottom 0.203: v3.68,48.9 4.32,48.9 5.41,47.83 7.95,47.83 14.48,41.27 v14.48,36.96
  Bottom 0.254: H4.2 60.96,49.53 62.87,47.62 62.87,37.85 59.54,34.53 58.69,34.53 v58.42,34.8 | v19.81,38.86 20.32,39.37 20.32,46.48 18.41,48.39 18.41,48.9 v18.29,49.28
D2  (via drill 0.4)
  Top 0.254: IC5.32 60.53,35.31 v59.31,35.31
  Bottom 0.254: H4.3 58.42,50.29 60.07,48.64 60.96,48.64 62.23,47.37 62.23,38.15 59.41,35.33 59.33,35.33 v59.31,35.31
D3  (via drill 0.4)
  Top 0.254: IC5.1 59.82,36.83 v59.94,36.96 | SJ5.3 v34.29,39.37 | v34.29,42.67 34.29,46.99 34.8,47.5 58.93,47.5 v59.44,48.01
  Bottom 0.254: v59.94,36.96 61.59,38.61 61.59,47.12 60.96,47.75 59.69,47.75 v59.44,48.01 58.17,49.28 56.9,49.28 55.88,50.29 H4.4 | v34.29,39.37 v34.29,42.67
D4  (via drill 0.4)
  Top 0.254: v58.29,38.23 58.29,36.85 IC5.2 | RN2.5 54.41,26.6 v54.74,26.92 | v57.78,31.55 v57.78,32.97
  Bottom 0.254: H4.5 53.34,50.29 54.36,49.28 56.01,49.28 56.64,48.64 57.4,48.64 58.93,47.12 60.58,47.12 60.96,46.74 60.96,39.37 59.82,38.23 v58.29,38.23 58.29,36.45 57.53,34.67 57.51,33.22 v57.78,32.97 | v54.74,26.92 56.52,26.92 57.78,28.19 v57.78,31.55
D5  (via drill 0.4)
  Top 0.254: IC5.9 51.99,35.31 v54.48,35.31
  Bottom 0.254: v54.48,35.31 54.48,37.85 48.9,43.43 48.9,48.64 50.8,50.55 H4.6
D6  (via drill 0.4)
  Top 0.254: IC5.10 51.98,34.54 52.83,34.54 53.09,34.8 53.85,34.8 54.23,34.42 v54.86,34.42
  Bottom 0.254: v54.86,34.42 54.23,34.42 53.72,34.92 53.72,37.85 48.26,43.31 H4.7
D7  (via drill 0.4)
  Top 0.254: IC5.11 53.16,33.73 v53.47,34.04 | v36.83,35.05 SJ4.3 | v41.4,42.42 41.4,45.59 41.78,45.97 46.86,45.97 48.01,44.83 v48.01,42.16
  Bottom 0.254: H4.8 45.72,50.55 47.62,48.64 47.62,42.55 v48.01,42.16 53.09,37.08 53.09,34.42 v53.47,34.04 | v36.83,35.05 38.1,35.05 41.4,38.35 v41.4,42.42
D8  (via drill 0.4)
  Top 0.254: IC5.12 52.7,32.89 53.06,33.25 54.12,33.26 v54.36,33.53
  Bottom 0.254: 43.31,50.8 44.7,49.4 45.97,49.4 46.99,48.39 46.99,41.91 52.45,36.45 52.45,33.78 52.96,33.27 54.1,33.27 v54.36,33.53
  Bottom 0.305: 43.31,50.8 H1.1
D9  (via drill 0.4)
  Top 0.254: IC5.13 52.7,32.13 53.09,32.51 v53.98,32.51 | v36.07,36.58 36.07,35.81 35.31,35.05 SJ5.1 34.29,36.58 | v42.42,41.91 42.42,44.7 42.93,45.21 46.74,45.21 47.24,44.7 47.24,41.78 v46.61,40.89
  Bottom 0.254: v53.98,32.51 52.32,32.51 51.82,33.02 51.82,34.42 46.61,39.62 v46.61,40.89 46.35,41.15 46.35,48.13 45.72,48.77 44.45,48.77 43.81,49.4 40.01,49.4 39.12,50.29 | v36.07,36.58 35.81,36.58 35.31,36.07 35.31,34.54 35.81,34.04 39.12,34.04 42.16,37.08 42.16,40.89 42.42,41.15 v42.42,41.91
  Bottom 0.305: 39.12,50.29 H1.2
D10_SS  (via drill 0.4)
  Top 0.254: v53.34,31.75 52.87,31.33 IC5.14 50.08,31.33 49.53,31.88 IC6.9
  Bottom 0.254: v53.34,31.75 53.21,31.88 52.2,31.88 51.05,33.02 51.05,33.78 45.72,39.12 45.72,47.5 45.21,48.01 44.2,48.01 43.69,48.51 39.37,48.51 37.21,50.67 36.45,50.67
  Bottom 0.305: 36.45,50.67 H1.3
D11_MOSI  (via drill 0.4)
  Top 0.203: v49.66,27.05 50.8,28.19 v50.8,29.08 50.8,29.97 51.36,30.53 IC5.15
  Top 0.254: IC5.15 56.72,30.53 57.91,29.34 59.44,29.34 62.1,26.67 64.52,26.67 | 64.52,26.67 64.58,26.67 | 64.52,26.67 65.74,27.89 P2.4 | RN2.6 53.61,26.65 v53.34,26.92 | IC6.5 42.8,35.69 45.09,37.97 v45.09,38.61
  Bottom 0.203: v53.34,26.92 53.09,26.67 50.04,26.67 v49.66,27.05 | 45.09,45.34 44.58,45.85 | 45.28,38.67 49.66,34.29 49.66,30.35 50.8,29.21 v50.8,29.08
  Bottom 0.254: 34.42,50.42 34.42,46.74 35.31,45.85 44.58,45.85 | 45.28,38.67 v45.09,38.61 45.09,39.75 45.21,39.88 45.21,45.21 45.09,45.34
  Bottom 0.305: 34.42,50.42 H1.4
D12_MISO  (via drill 0.4)
  Top 0.203: v51.82,28.83 51.94,28.96 51.94,29.7 IC5.16 | IC4.15 24.4,27.58 24.64,27.81 25.27,27.81 26.8,29.34 v28.96,29.34
  Top 0.254: P5.7 62.9,12.16 62.87,12.19 v64.26,12.19 | v43.69,34.42 43.69,35.43 v45.21,36.96
  Bottom 0.203: 44.58,44.7 44.2,45.09 | 46.35,36.7 49.15,33.91 49.15,29.59 50.42,28.32 51.05,28.32 v51.82,28.83 51.82,29.97 52.83,30.99 53.59,30.99 55.75,33.15 56.77,33.15 57.4,32.26 61.59,32.26 61.72,32.38 62.74,32.38 63.63,31.5 63.63,30.44 P2.1
  Bottom 0.254: v64.26,12.19 64.26,21.97 62.36,23.88 62.36,28.45 63.64,29.73 P2.1 | 44.2,45.09 35.18,45.09 33.66,46.61 33.66,48.64 | v28.96,29.34 31.75,32.13 42.29,32.13 42.8,32.64 42.8,33.78 43.43,34.42 v43.69,34.42 | 44.58,44.7 44.7,44.58 44.7,40.13 44.2,39.62 44.2,37.97 v45.21,36.96 46.1,36.96 46.35,36.7
  Bottom 0.305: 33.66,48.64 H1.5
D13_SCK  (via drill 0.4)
  Top 0.254: P2.3 64.9,29.15 64.9,29.21 | 64.9,29.21 64.9,30.99 66.17,32.26 66.17,33.02 65.91,33.27 65.15,33.27 64.77,32.89 63.5,32.89 63.25,33.15 63.25,34.04 62.55,34.73 Q2.1 | 53.46,28.32 52.45,27.3 52.45,26.8 52.83,26.42 52.83,26.09 RN2.7 | v53.47,29.59 v53.46,29.59 53.46,28.32 | 53.46,28.32 IC5.17 | 64.9,29.21 66.8,29.21 67.44,28.57 67.44,27.18 66.8,26.54 65.28,26.54 64.9,26.16 64.9,24.51 65.15,24.26 65.15,22.23 64.52,21.59 57.4,21.59 v56.52,22.48 | v45.21,35.81 45.21,34.29 44.7,33.78 44.7,32.51 44.45,32.26 43.43,32.26 42.67,33.02 42.02,33.02 IC6.7
  Bottom 0.203: 48.64,29.34 50.85,27.13 52.35,27.13 52.98,27.75 53.66,27.75 | v56.52,22.48 54.08,24.92 54.08,27.33 53.66,27.75 | 53.66,27.75 53.47,27.94 v53.47,29.59 arc91 53.46,29.46 IC5.17
  Bottom 0.254: 48.64,29.34 48.64,33.66 46.48,35.81 v45.21,35.81 43.69,37.34 43.69,39.88 44.2,40.39 44.2,43.69 43.43,44.45 34.8,44.45 32.89,46.35
  Bottom 0.305: H1.6 32.89,46.86 32.89,46.35
DTR  (via drill 0.4)
  Top 0.203: IC2.13 v9.66,51.69 v9.65,51.69 | 35.69,42.04 SJ3.1
  Top 0.254: v35.69,46.74 35.69,42.04 | SJ3.1 37.08,41.91
  Bottom 0.203: v9.65,51.69 9.65,51.49 SJ2.2 12.11,50.46 13.59,51.94 13.59,52.32 14.1,52.7 34.8,52.7 35.31,52.2 35.31,47.12 v35.69,46.74
GND  (via drill 0.4)
  Top 0.203: IC2.3 12.19,47.75
  Top 0.254: IC2.3 10.66,47.76 IC2.EXP | 12.19,47.75 13.21,47.75 13.84,48.39 16.51,48.26 16.76,48.01 17.53,48.01 17.65,48.13 18.41,48.13 | C9.2 1.44,44.66 v1.85,44.2 | RN4.1 57.22,6.92 57.28,6.86 58.02,6.86 | RN4.3 58.8,7.43 58.8,6.99 58.67,6.86 58.02,6.86 | RN4.2 58.02,6.86 | P5.6 61.73,13.22 v61.09,12.32 | Q2.2 62.55,32.83 63.12,32.26 65.15,32.26 v65.41,32.51 | IC5.21 56.66,29.57 v56.52,29.72 | v56.44,32.38 56.44,32.72 57.53,33.78 57.53,35.43 57.28,35.69 | v67.44,32.51 68.07,31.88 68.07,25.65 67.77,25.35 P2.6 | IC4.19 21.22,24.12 20.19,25.15 | RN2.1 52.07,24.64 v52.07,23.62
  Top 0.305: IC5.5 55.88,36.8 55.88,35.69 57.28,35.69 57.4,35.69 57.46,35.74 IC5.3 57.46,38.13 56.77,38.86 C22.2
  Top 0.406: v50.67,11.68 C23.2 | C22.2 56.73,39.88 | 56.73,39.88 C17.1 | 56.73,39.88 v57.78,39.88 | C11.2 27.27,37.55 v27.94,38.23
  Top 0.61: 66.8,23.37 66.75,23.42 66.75,24.78 P2.6
  Top 1.27: v38.35,12.83 38.35,12.19 30.48,12.19 v30.23,12.83 | v38.35,12.83 v38.35,13.59 | v38.35,13.59 v38.35,14.35 | v38.35,14.35 v38.35,15.11 | v38.35,15.11 v38.35,15.88 | v38.35,15.88 v38.35,16.64 v30.23,16.64 v30.23,15.88 | v30.23,12.83 v30.23,13.59 | v30.23,13.59 v30.23,14.35 | v30.23,14.35 v30.23,15.11 | v30.23,15.11 v30.23,15.88 | v30.23,15.88 v38.35,15.88 | v30.23,15.11 v38.35,15.11 | v30.23,14.35 v38.35,14.35 | v30.23,13.59 v38.35,13.59 | v30.23,12.83 v38.35,12.83 | 31.5,11.43 37.08,11.43
  Bottom 0.254: v1.85,44.2 2.41,43.68 SJ1.2 | v56.52,29.72 57.15,30.35 57.15,31.24 56.9,32 v56.44,32.38 | SJ2.1 11.98,48.94 12.7,49.66 13.46,49.66 14.48,48.64 15.37,48.64 v16.13,47.88 | v67.44,32.51 v65.41,32.51
  other vias: 48.26,2.54 58.29,20.7 58.29,19.94 18.16,47.37 2.54,51.82 20.7,47.62 1.02,48.01 65.15,20.7 65.15,19.94 65.02,50.8 52.2,48.51 19.43,43.81 48.26,1.65 36.7,5.97 48.26,5.21 48.26,6.1 6.17,41.4 6.93,41.4 37.59,17.02 37.59,16.26 37.59,15.49 37.59,14.73 37.59,13.97 37.59,13.21 37.59,12.45 30.99,17.02 30.99,16.26 30.99,15.49 30.99,14.73 30.99,13.97 30.99,13.21 30.99,12.45 30.23,12.06 38.35,12.06 27.43,23.11 31.62,11.18 32.38,11.18 33.15,11.18 33.91,11.18 34.67,11.18 35.43,11.18 36.2,11.18 36.96,11.18 11.68,15.62 11.68,14.86 11.68,14.1 15.24,15.62 15.24,14.86 15.24,14.1 46.35,30.48 46.35,29.72 45.85,26.42 46.61,26.42 23.62,23.62 17.65,28.96 19.81,26.42 52.07,20.57 52.07,19.81 1.27,26.54 1.27,25.78 1.27,25.02 1.27,20.95 1.27,20.19 1.27,19.43 35.94,5.97 35.18,5.97 30.1,35.05 30.86,35.05 17.4,42.8 1.47,32.77 4.01,33.27 4.78,33.27 50.42,32.26 50.42,30.61 30.1,44.2 37.85,46.74 37.59,49.15 29.59,42.42 50.42,37.08 41.02,12.57 41.53,13.08 42.04,9.02 42.8,9.78 40.51,12.06 41.53,8.51 42.04,13.59 43.43,10.41 41.91,18.03 41.91,17.27 44.7,17.27 47.5,18.03 47.5,17.27 20.57,17.14 20.07,16.38 19.56,15.62 27.3,4.45 27.05,6.99 26.29,6.99 19.68,12.57 21.97,2.41 28.19,4.45 19.68,11.81 19.68,11.05 22.99,2.41 32.89,40.13 51.94,45.47 53.47,5.97 65.15,13.84
  pour Bottom: 0,50.8 arc-74 2.54,53.34 63.5,53.34 arc-74 66.04,50.8 66.04,40.64 68.58,38.1 68.58,5.08 66.04,2.54 arc-74 63.5,0 2.54,0 arc-74 0,1.91
  pour Top: 0,50.8 arc-74 2.54,53.34 63.5,53.34 arc-74 66.04,50.8 66.04,40.64 68.58,38.1 68.58,5.08 66.04,2.54 arc-74 63.5,0 2.54,0 arc-74 0,1.91
MISO2  (via drill 0.4)
  Top 0.203: IC2.17 7.61,50.69 v6.6,51.69
  Bottom 0.203: v6.6,51.69 8.38,49.91 8.38,48.01 15.37,41.02 15.37,37.47 16.13,36.7 18.03,36.7 18.54,36.2 18.54,32.38 19.05,31.88 20.45,31.88 21.08,32.51 21.08,34.04 22.35,35.31 P4.1
MOSI2  (via drill 0.4)
  Top 0.203: IC2.16 8.16,51.15 v7.62,51.69
  Bottom 0.203: v7.62,51.69 8.89,50.42 8.89,48.13 15.88,41.15 15.88,37.69 16.41,37.16 19.86,37.16 21.08,35.94 21.08,34.92 19.81,33.66 P4.4
MOSI_3V3  (via drill 0.4)
  Top 0.203: IC4.16 23.9,27.84 v24.77,28.7
  Top 0.254: IC6.4 40.77,36.96 40.39,36.58 40.39,33.53 39.88,33.02 33.02,33.02 32,32 v28.07,32
  Bottom 0.254: v24.77,28.7 v28.07,32
N$1
  Top 0.254: P3.D- 14.84,23.99 16.26,25.4 R6.2
N$2
  Top 0.254: IC5.7 54.26,37.43 53.05,38.65 R9.2 54.83,40.77 C17.2 55.03,43.47 X3.2
N$3
  Top 0.254: P3.D+ 14.88,21.99 16.51,23.62 R7.2
N$4
  Top 0.254: R10.2 61.63,37.5 62.36,38.23 LED5.C
N$5
  Top 0.254: IC4.20 20.96,23.62 19.18,25.4 R6.1
N$6
  Top 0.254: R10.1 63.33,35.17 64.14,34.42 64.14,33.87 Q2.3
N$7
  Top 0.254: IC5.8 52.97,36.82 51.44,38.35 51.44,38.9 R9.1 53.05,40.69 C18.2 53.05,41.82 X3.1
N$8
  Top 0.203: R2.1 13.59,41.74 13.59,46.1 12.93,46.76 IC2.1
N$10
  Top 0.254: IC4.21 20.19,23.12 19.68,23.62 R7.1
N$11
  Top 0.203: LED3.C 3.25,47.06 2.79,47.5 2.79,49.28 3.17,49.66 3.68,49.66 4.06,50.04 4.59,50.04 RN3.2
N$12  (via drill 0.4)
  Top 0.254: RN1.5 33.2,43.25 33.02,43.43 32.51,43.43 | 32.51,43.43 32.38,43.31 32.38,42.6 RN1.6 | 32.51,43.43 29.08,46.86 v28.45,46.86 25.27,46.86 24.89,46.48 IC3.3 | R11.1 28.45,40.42 v28.45,42.42
  Bottom 0.254: v28.45,42.42 v28.45,46.86
N$13
  Top 0.203: LED2.C 3.92,50.65 4.06,50.8 4.55,50.8 RN3.1
N$14  (via drill 0.4)
  Top 0.203: RN2.8 51.42,26.07 51.31,25.96 v51.18,25.96
  Top 0.254: LED1.C 62.88,40.78 63.12,41.02 65.02,41.02 65.41,40.64 65.41,39.5 v65.91,38.99 | v56.64,23.5 56.77,23.62 v63.75,23.62
  Bottom 0.254: v65.91,38.99 65.91,38.35 64.01,36.45 64.01,32.77 65.15,31.62 66.8,31.62 67.44,30.99 67.44,24.51 66.55,23.62 v63.75,23.62 | v56.64,23.5 57.02,23.5 57.28,23.24 57.28,21.84 56.77,21.34 55.88,21.34 51.26,25.96 v51.18,25.96
N$15  (via drill 0.4)
  Top 0.203: IC4.26 24.4,20.55 23.88,21.08 v23.88,21.34 | v37.72,18.03 40.51,18.03 41.66,19.18 44.07,19.18 44.58,19.68 47.37,19.68 49.02,21.34 H5.1
  Bottom 0.203: v23.88,21.34 23.88,20.32 26.16,18.03 v37.72,18.03
N$16
  Top 0.254: Z1.1 10.24,39.2 R4.2
  Top 0.305: Z1.1 10.07,39.12 9.53,39.12 8.51,38.1 P1.D+
N$17
  Top 0.254: Z2.1 R3.2
  Top 0.305: Z2.1 10.12,41.02 9.4,41.02 8.89,40.51 8.89,39.37 8.27,38.75 P1.D-
N$18
  Top 0.254: 24.89,38.48 IC3.6 | 24.89,38.48 25.78,38.48 26.16,38.86 IC3.7 | 24.7,35.24 Q1.1 24.81,36.15 24.51,36.45 24.51,38.1 24.89,38.48
N$19
  Top 0.254: IC3.5 23.62,41.27 24.38,42.04 25.65,42.04 27.43,43.81 IC3.1
N$20  (via drill 0.4)
  Top 0.254: RN2.4 54.41,22.68 59.44,17.65 v61.21,17.65 62.46,17.65 P5.2 | RN4.8 57.22,11.5 v59.94,14.22
  Bottom 0.254: v59.94,14.22 61.21,15.49 v61.21,17.65
N$21
  Top 0.254: 56.9,26.54 56.9,26.92 57.46,27.5 IC5.22
  Top 0.305: 56.9,26.54 58.04,25.4 A2.1
N$22
  Top 0.254: 56.13,26.54 55.06,27.62 IC5.19
  Top 0.305: 56.13,26.54 A1.1
N$23
  Top 0.254: P5.CD1 54.59,11.83 56.01,10.41 56.01,5.59 56.9,4.7 60.2,4.7 61.98,6.48 CD.1
N$24
  Top 0.254: RN2.2 52.81,22.5 57.78,17.53 57.78,16.13 58.8,15.11 60.33,15.11 61.21,14.22 | 61.21,14.22 62.8,14.22 P5.5 | RN4.7 58.02,9.51 60.07,11.56 60.07,13.08 61.21,14.22
N$25
  Top 0.254: RN2.3 53.61,22.59 59.69,16.51 62.89,16.51 P5.3 64.52,16.51 66.17,14.86 66.17,12.95 64.26,11.05 64.26,10.29 64.01,10.03 59.44,10.03 58.82,9.42 RN4.6
N$26  (via drill 0.4)
  Top 0.203: H5.2 46.1,20.19 44.32,20.19 43.81,19.68 41.4,19.68 40.26,18.54 38.61,18.54 v38.35,18.8 | v24.64,22.1 24.64,21.08 24.9,20.82 IC4.27
  Bottom 0.203: v38.35,18.8 26.16,18.8 24.64,20.32 v24.64,22.1
N$27
  Top 0.254: IC4.25 23.9,19.2 23.75,18.29 X2.2
  Top 0.406: C15.2 26.42,13.12 26.42,14.22 24.13,16.51 X2.2
N$28  (via drill 0.4)
  Top 0.203: H5.3 43.56,20.19 41.15,20.19 40.26,19.3 v39.24,19.3 | v25.4,21.34 v25.4,21.33 IC4.28
  Bottom 0.203: v39.24,19.3 38.99,19.56 26.8,19.56 25.4,21.08 v25.4,21.34
N$29
  Top 1.016: JP1.1 21.97,27.69 24.3,29.97 26.16,29.97 26.8,30.61 C13.A 34.24,30.6 F2.1 34.25,30.6
N$30
  Top 0.254: IC4.24 22.15,20.25 X2.1
  Top 0.406: C16.2 20.99,14.22 19.05,14.22 17.4,15.88 X2.1
N$31
  Top 0.203: IC4.29 25.9,19.82 25.91,19.81 25.91,18.54 26.54,17.91 28.07,17.91 28.83,18.67 33.53,18.67 34.04,19.18 35.81,19.18 36.32,19.68 38.1,19.68 38.61,20.19 40.39,20.19 41.53,21.34 H5.4
N$32
  Top 0.203: IC4.30 26.4,18.81 26.8,18.41 27.94,18.41 28.7,19.18 33.27,19.18 33.78,19.68 35.56,19.68 36.07,20.19 37.85,20.19 38.99,21.34 H5.5
N$33
  Top 0.203: H5.6 36.45,21.34 35.31,20.19 33.53,20.19 33.02,19.68 28.57,19.68 27.81,18.92 27.05,18.92 26.92,19.05 26.92,19.85 IC4.31
N$34
  Top 0.203: H5.7 33.91,21.34 32.77,20.19 28.32,20.19 28.07,19.94 27.48,19.94 IC4.32
N$35
  Top 0.203: IC4.1 31.72,21.62 H5.8
N$36
  Top 0.203: IC4.4 30.22,23.12 30.86,22.48 48.13,22.48 H6.1
N$37
  Top 0.203: H6.2 46.1,22.99 31.11,22.99 30.48,23.62 IC4.5
N$38
  Top 0.203: H6.3 42.55,26.29 28.19,26.29 27.05,25.15 27.05,24.51 27.44,24.12 IC4.6
N$39
  Top 0.203: IC4.7 27.83,24.62 27.56,24.89 27.56,25.02 28.32,25.78 40.51,25.78 H6.4
N$40
  Top 0.203: H6.5 38.48,25.27 30.35,25.27 30.2,25.12 IC4.8
N$41  (via drill 0.4)
  Top 0.203: IC4.9 36.77,26.87 v37.08,27.18
  Bottom 0.203: v37.08,27.18 H6.6
N$42  (via drill 0.4)
  Top 0.203: IC4.10 26.9,27.54 27.18,27.81 27.81,27.81 28.19,27.43 34.29,27.43 v34.54,27.69
  Bottom 0.203: v34.54,27.69 H6.7
N$43  (via drill 0.4)
  Top 0.203: IC4.11 26.4,27.67 27.05,28.32 27.94,28.32 28.32,27.94 31.75,27.94 v32,28.19
  Bottom 0.203: v32,28.19 H6.8
N$44
  Top 0.254: R5.1 11.18,30.99 10.54,31.62 7.24,31.62 6.86,31.24 LED4.A
N$45
  Top 1.016: P3.SHELL1 P3.SHELL2 7.66,14.99 L3.1
N$46
  Top 1.016: L1.1 40.13,30.73 F2.2
N$48
  Top 0.254: IC4.22 20.84,22.62 20.07,21.84 C21.2
N$49
  Top 0.254: SJ3.2 37.59,41.91 38.19,42.51 C14.1
N$50
  Bottom 0.406: 5.84,43.69 4.57,43.69
N$51  (via drill 0.4)
  Top 0.254: 10.16,37.08 Z1.2
  Top 0.305: 4.32,35.31 6.35,33.27 6.35,32.64 6.73,32.26 10.54,32.26 10.92,32.64 10.92,36.07 10.16,36.83 Z1.2
  Top 0.406: Z2.2 10.12,42.8 9.14,42.8 8.95,42.6 4.83,42.6 | 4.83,42.6 L2.1 | 4.83,42.6 3.52,41.29 3.52,41.11 | 4.32,35.31 4.1,35.53 P1.PIN2
  Top 0.813: P1.FIX1 1.45,41.52 P1.TAB1 2.9,41.73 3.52,41.11 P1.PIN1 | P1.PIN2 2.9,34.48 P1.TAB2 1.45,34.67 P1.FIX2 P1.FIX1 | v1.45,38.35 1.49,39.4 P1.FIX1
  Bottom 0.813: v1.45,38.35 v1.45,37.72
N$60
  Top 0.406: 21.8,9.65 D1.A
  Top 0.813: 21.8,9.65 13.7,9.65 J1.PWR
N$113
  Top 0.203: IC2.2 13.19,47.26 14.1,46.35 14.1,44.66 R1.2
  Top 0.254: R1.2 17.11,43.78 X1.2 19.81,45.21 21.08,43.94 21.8,43.94 C2.2
N$114
  Top 0.203: C6.2 21.93,38.52 20.07,40.39 X1.1 17.53,40.39 15.66,38.52 R2.2
  Top 0.254: R1.1 16.85,42.08 X1.1
N$115  (via drill 0.4)
  Top 0.305: P1.VBUS 5.11,39.4 5.33,39.62 v5.84,39.62
  Top 0.61: 9.1,35.31 F1.1
  Top 0.813: v5.84,35.31 9.1,35.31 | v5.84,39.62 v6.6,39.62
  Bottom 0.813: v6.6,35.31 v5.84,35.31 v5.84,39.62 v6.6,39.62
N$117
  Top 0.203: 9.14,46.2 9.14,45.72 8.89,45.47 7.87,45.47 7.49,45.85 3.9,45.85 C9.1
  Top 0.254: 9.14,46.2 IC2.27
RD+  (via drill 0.4)
  Top 0.254: R4.1 11.98,39.24 v12.95,39.24 | v10.16,43.94 IC2.29
  Bottom 0.254: v12.95,39.24 12.95,41.15 v10.16,43.94
RD-
  Top 0.254: R3.1 11.98,42.84 11.99,42.85 11.96,43 11.96,43.54 10.66,44.84 IC2.30
RES_3V3
  Top 0.203: IC4.12 25.9,27.81 26.92,28.83 28.19,28.83 28.57,28.45 31.11,28.45 31.62,28.96 32.26,28.96 32.77,28.45 46.23,28.45 47.12,29.34 47.12,30.73 45.21,32.64 45.21,33.66 45.97,34.42 45.97,38.73 45.21,39.5 IC6.2
RESET  (via drill 0.4)
  Top 0.203: RN1.2 31.6,41.76 31.75,41.91 34.29,41.91 34.42,41.78 34.42,40.89 34.67,40.64 37.97,40.64 38.14,40.81 C14.2
  Top 0.254: IC5.29 59.22,32.93 v59.05,33.02 | v64.26,42.93 64.52,42.67 S1.4 S1.3 59.44,43.18 56.01,46.61 40.77,46.61 40.39,46.23 v40.39,41.91 40.39,41.4 39.79,40.81 C14.2 | v58.04,22.48 64.14,22.48 64.52,22.86 64.52,24 63.63,24.89 63.63,25.34 P2.5 | v36.83,39.37 36.83,38.86 37.59,38.1 SJ4.1 38.35,36.58
  Top 0.305: v52.32,4.95 52.2,4.95 51.18,3.94 40.13,3.94 39.37,3.17 39.37,1.91 38.86,1.4 34.16,1.4 H2.3
  Bottom 0.254: P2.5 64.9,26.61 64.9,30.99 62.36,33.53 60.96,33.53 | v64.26,42.93 64.26,37.47 60.96,34.16 60.96,33.53 | v52.32,4.95 53.98,4.95 57.66,8.64 57.66,14.61 59.31,16.26 59.31,21.59 58.42,22.48 v58.04,22.48 | v59.05,33.02 59.56,33.53 60.96,33.53 | v36.83,39.37 36.83,40.89 37.85,41.91 v40.39,41.91
RESET2  (via drill 0.4)
  Top 0.203: IC2.24 5.87,46.76 v5.71,46.61 | 20.45,37.21 20.83,37.59 23.11,37.59 v23.62,38.1
  Top 0.254: P4.5 17.27,36.7 17.78,37.21 20.45,37.21 | v29.21,41.15 30.61,41.15 30.73,41.16 RN1.1
  Bottom 0.254: v5.71,46.61 5.71,45.85 6.22,45.34 8.76,45.34 9.4,44.7 9.4,36.32 9.4,34.54 10.16,33.78 15.49,33.78 P4.5 | v23.62,38.1 26.16,38.1 v29.21,41.15
RXLED
  Top 0.203: IC2.10 11.16,52.22 10.54,52.83 5.97,52.83 5.28,52.15 5.28,50.22 5.46,50.04 5.94,50.04 RN3.7
SCK2  (via drill 0.4)
  Top 0.203: IC2.15 8.66,51.67 v8.64,51.69 | P4.3 20.07,35.56 v21.34,36.83
  Bottom 0.203: v8.64,51.69 9.4,50.93 9.4,48.26 16.38,41.27 16.38,37.97 16.76,37.59 20.57,37.59 v21.34,36.83
SCK_3V3  (via drill 0.4)
  Top 0.203: IC4.13 25.4,26.16 v26.04,25.53
  Top 0.254: v43.94,33.15 42.67,34.42 IC6.6
  Bottom 0.254: v26.04,25.53 26.29,25.53 30.86,30.1 30.86,30.48 31.88,31.5 42.93,31.5 43.94,32.51 v43.94,33.15
SS_3V3  (via drill 0.4)
  Top 0.203: IC4.14 24.9,25.64 v25.02,25.53
  Top 0.254: v46.48,33.15 IC6.10
  Bottom 0.254: v25.02,25.53 25.78,24.77 26.42,24.77 31.5,29.84 31.5,30.23 32,30.73 43.05,30.73 45.47,33.15 v46.48,33.15
TXLED
  Top 0.203: IC2.11 10.66,51.95 10.21,52.4 6.17,52.4 5.84,52.07 5.84,51.56 5.97,51.44 5.97,50.87 RN3.8
USB_GPX  (via drill 0.4)
  Top 0.203: IC4.17 23.65,25.12 24.64,24.13 v24.64,23.88
  Bottom 0.203: v24.64,23.88 24.64,23.37 23.11,21.84 23.11,20.32 26.8,16.64 USB_GPX.1
USB_INT  (via drill 0.4)
  Top 0.203: IC4.18 21.48,24.62 20.95,25.15 20.95,25.53 v20.83,25.65
  Top 0.254: SJ5.2 34.2,36.49 v32,36.49 31.66,36.49 31.5,36.32 30.73,36.32 R8.2
  Bottom 0.254: v20.83,25.65 22.86,25.65 32,34.8 v32,36.49
USB_RESET
  Top 0.254: IC6.3 40.77,38.23 39.12,36.58 SJ4.2
USBGND  (via drill 0.4)
  Top 0.254: IC2.28 9.66,45.22 8.89,44.45 v8.38,44.45 | P1.GND 7.34,36.8 v7.62,36.83
  Top 0.406: v8.38,44.45 8.13,44.7 L2.2
  Bottom 0.406: v7.62,36.83 8.38,37.59 8.38,43.69 | 8.38,43.69 v8.38,44.45 | SJ1.1 7.48,43.69 8.38,43.69
USBRXD  (via drill 0.4)
  Top 0.203: RN3.5 6.69,48.46 v6.76,48.51 | IC2.9 11.66,51.15 v11.94,51.69
  Bottom 0.203: v11.94,51.69 11.25,52.38 6.15,52.38 5.84,52.07 5.84,51.44 7.62,49.66 7.62,48.9 7.24,48.51 v6.76,48.51
USBTXD  (via drill 0.4)
  Top 0.203: RN3.6 6.51,49.26 v6.76,49.51 | IC2.8 12.83,50.88 v12.83,52.2
  Bottom 0.203: v12.83,52.2 12.19,52.83 5.84,52.83 5.33,52.32 5.33,50.16 5.99,49.51 v6.76,49.51
USBVCC
  Top 0.254: IC2.31 11.16,45.61 11.16,45.49 11.43,45.21 12.95,43.69 12.95,40.64 13.72,39.88 13.72,38.61 13.21,38.1 13.21,34.75 F1.2
  Top 0.61: F1.2 14.4,32.85 16.13,31.11 22.86,31.11 23.62,31.88 25.74,31.88 27.01,33.15 Q1.3 27.05,34.16
VBUS
  Top 0.254: C12.2 14.64,29.55 13.84,30.35 13.84,30.95 R5.2 | 15.24,26.49 14.64,26.58
  Top 0.61: C12.2 14.64,26.58 14.61,26.54
  Top 0.813: P3.VBUS 13.36,26.54
  Top 1.016: JP1.2 17.78,27.69 17.27,27.18 16,27.18 15.31,26.49 15.24,26.49 P3.VBUS
VIN  (via drill 0.4)
  Top 0.254: RN1.3 32.4,40.79 v31.88,40.26 31.5,39.88 R11.2
  Top 0.406: v14.22,13.46 12.19,11.43 9.91,11.43 8.89,10.41 8.89,7.11 11.18,4.83 12.45,4.83 15.24,7.62 16.88,7.62 C3.+ 17.02,7.62 17.27,7.37
  Top 0.813: IC1.1 31.53,8.13 28.45,8.13 26.96,9.61 D1.C 24.68,7.37 17.27,7.37
  Top 1.016: v17.27,2.41 v17.27,3.43 17.27,7.37 | 31.98,7.65 IC1.1
  Bottom 0.254: v31.88,40.26 31.88,38.99 30.99,38.1 30.99,37.34 28.83,35.18 25.27,35.18 24.89,34.8 24.89,33.66 21.59,30.35 15.11,30.35 10.54,25.78 10.54,20.19 13.97,16.76 13.97,13.72 v14.22,13.46
  Bottom 1.016: v17.27,3.43 v17.27,2.41 18.8,0.89 45.09,0.89 45.72,1.52 H2.8

### Text on the board
tPlace: USB | TX | RX | SCL | SDA | A | GND | 13 | 12 | 11 | 10 | 9 | 8 | 7 | 6 | 5 | 4 | 3 | 2 | 1 | 0 | REF | PWM | PWM | PWM | Digital | PWM | PWM | PWM | TX | RX | USBDroid R3 | www.freetronics.com | RST | RST-EN | PWR | D3 | D13 | 1 | RST | D9 | D7 | UINT | URST | ICSP | VBUS | 1 | USB | VBUS | USB | 1 | GPOUT | V+ | 7 | 6 | 5 | 4 | 3 | 2 | 1 | 0 | A6 | A7 | D- | D+ | G | 7 | 6 | 5 | 4 | 3 | 2 | 1 | 0 | 4 | GPIN | GPX | 7-10V | DC | microSD | C | D | 2.1mm | IO | Power | Analog | SDA | SCL | REF | RST | 3V3 | 5V | GND | GND | VIN | 0 | 1 | 2 | 3 | 4 | 5
bPlace: SCL | SDA | A | GND | 13 | 12 | 11 | 10 | 9 | 8 | 7 | 6 | 5 | 4 | 3 | 2 | 1 | 0 | UBOOT | I2C | REF | PWM | PWM | PWM | Digital | PWM | PWM | PWM | TX | RX | GND | USBDroid | R3 | v2.0 | freetronics | CC | ROHS | SKU: | USBDROID | www.freetronics.com/usbdroid | by Marc Alexander | IO | Power | Analog | SDA | SCL | REF | RST | 3V3 | 5V | GND | GND | VIN | 0 | 1 | 2 | 3 | 4 | 5